# EasyEDA schematic SCH_GAME_SIM_2023-07-09.json

## Sheets
1 MCU: TITLE: SimSpirit MICROCONTROLLER  ESP32; REV: 1.0; Date: 2022-03-19; Sheet: 1/1; Drawn By: digitalman; Company: Analog-Digital Technologies
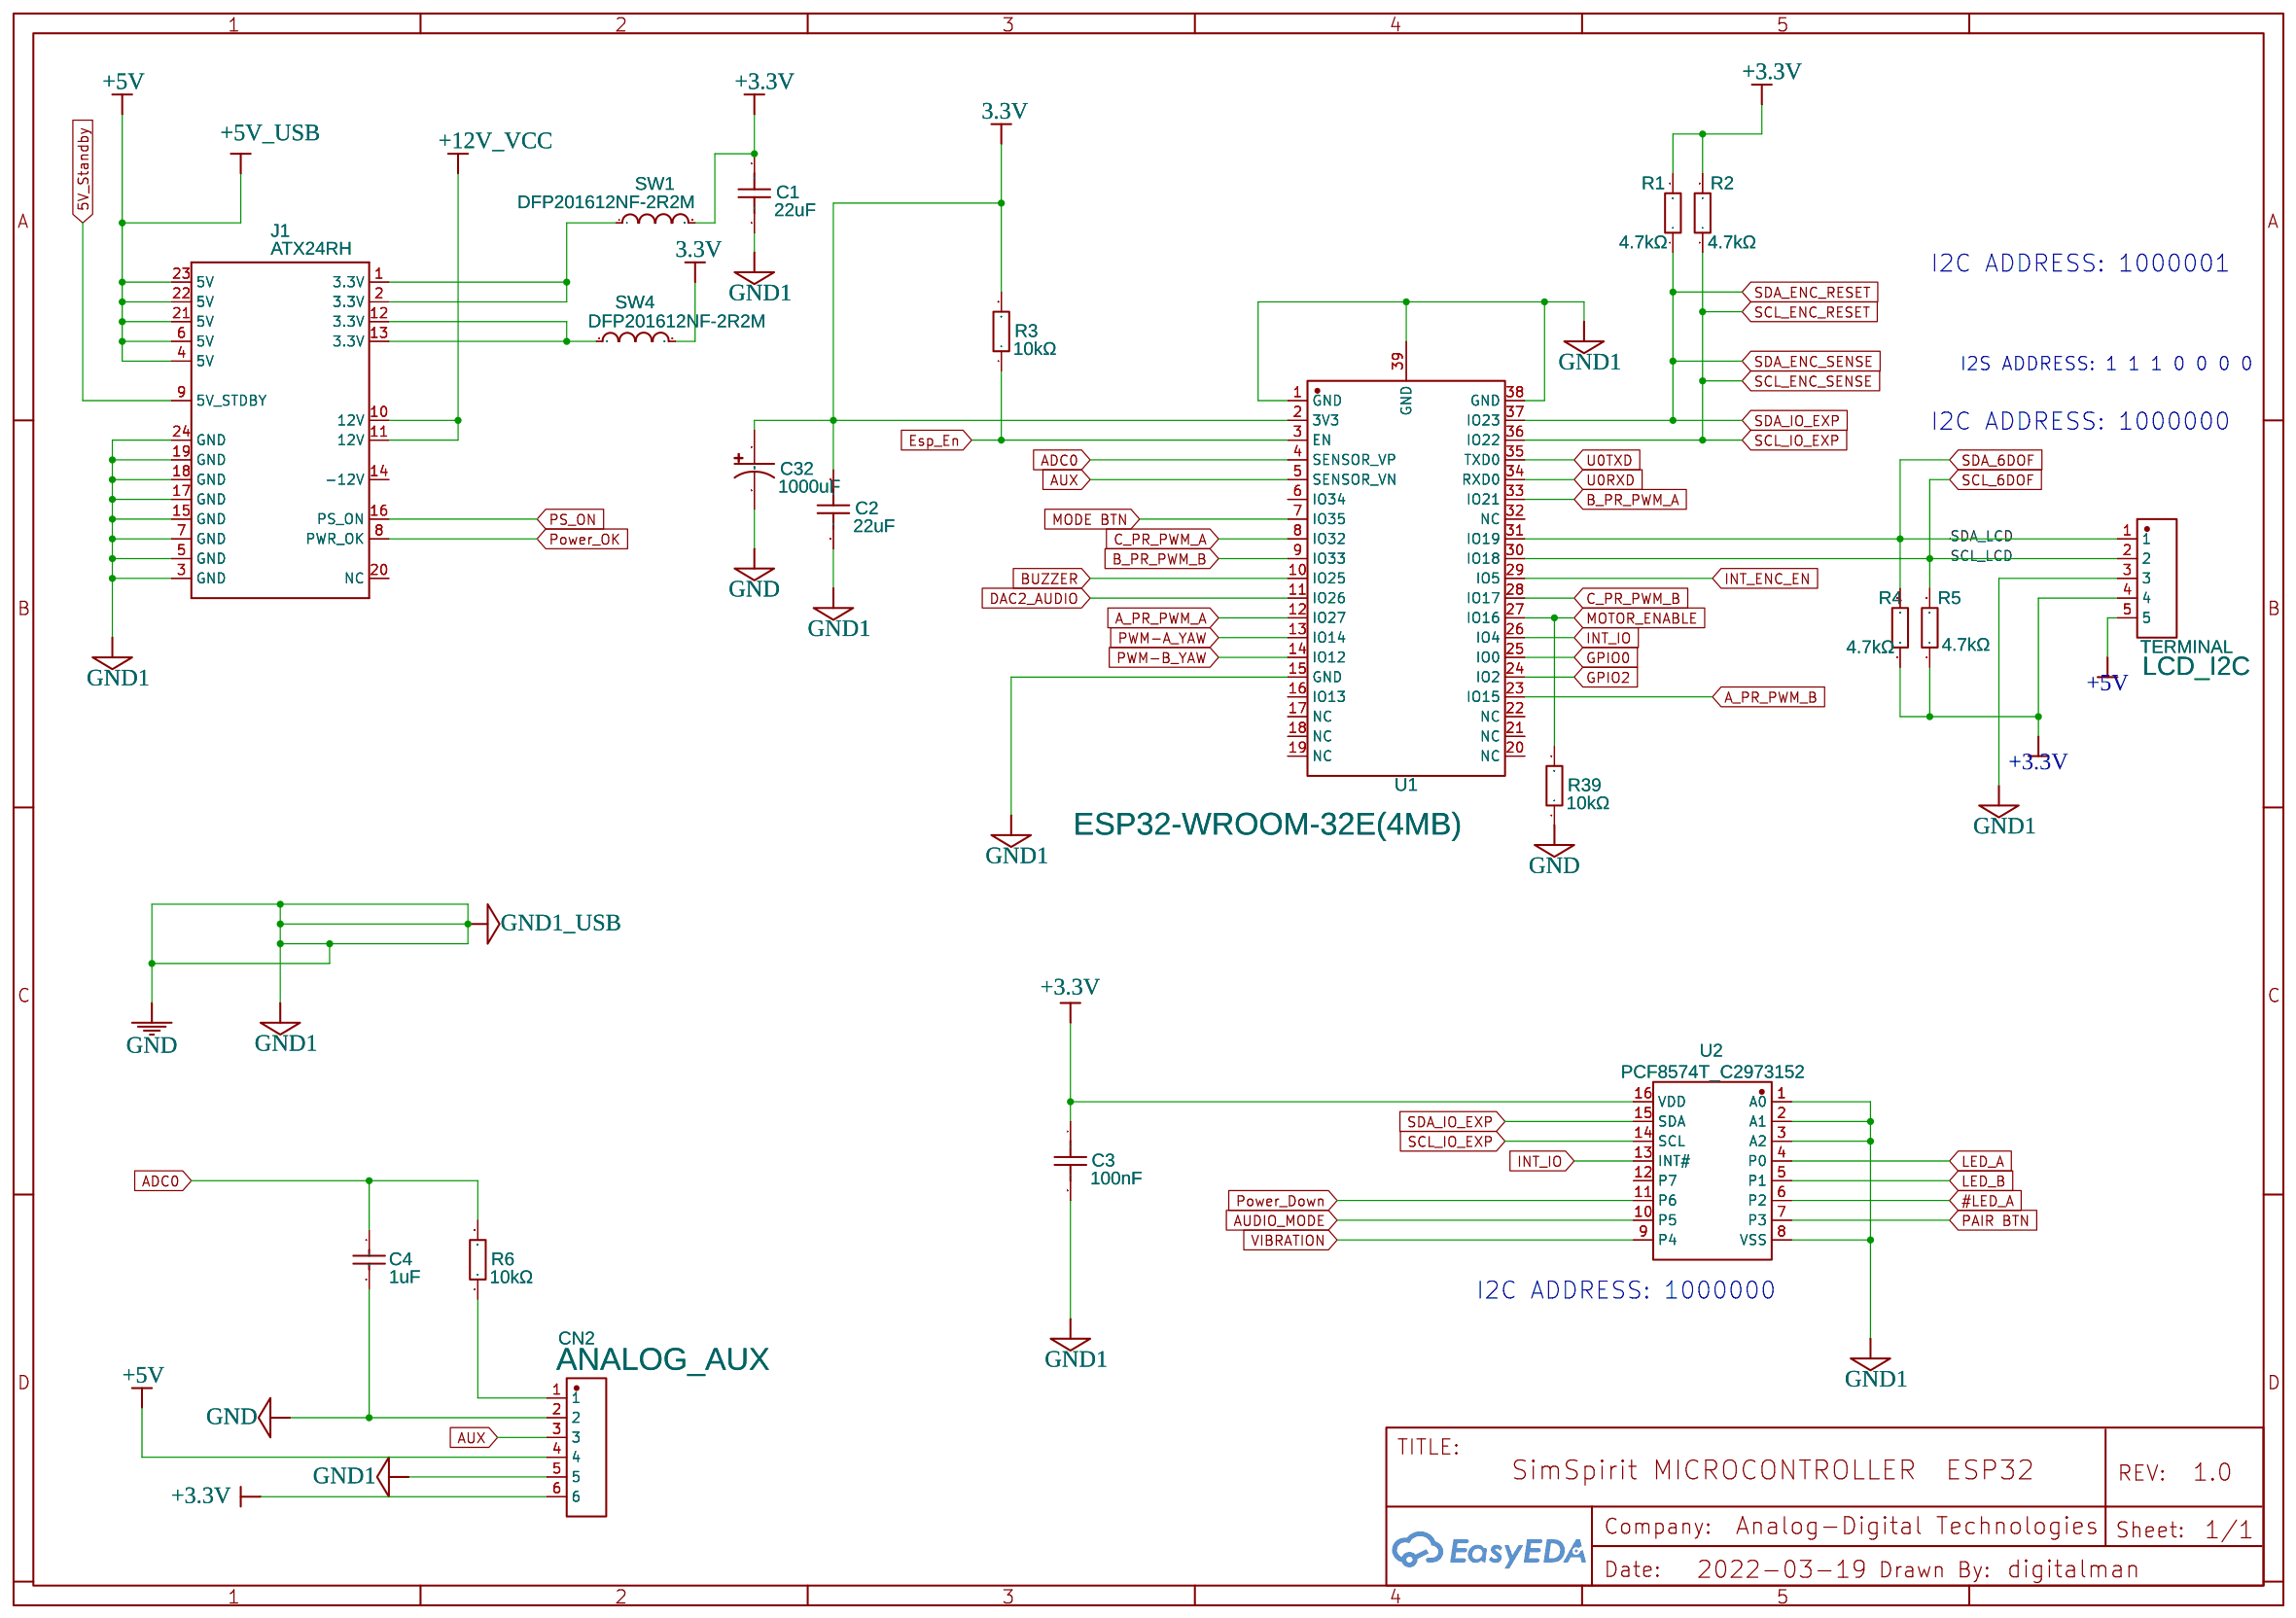
[diagram p0: MCU]
2 BUTTONS_LEDS: TITLE: SWITH AND BUTTONS; Date: 2022-03-21
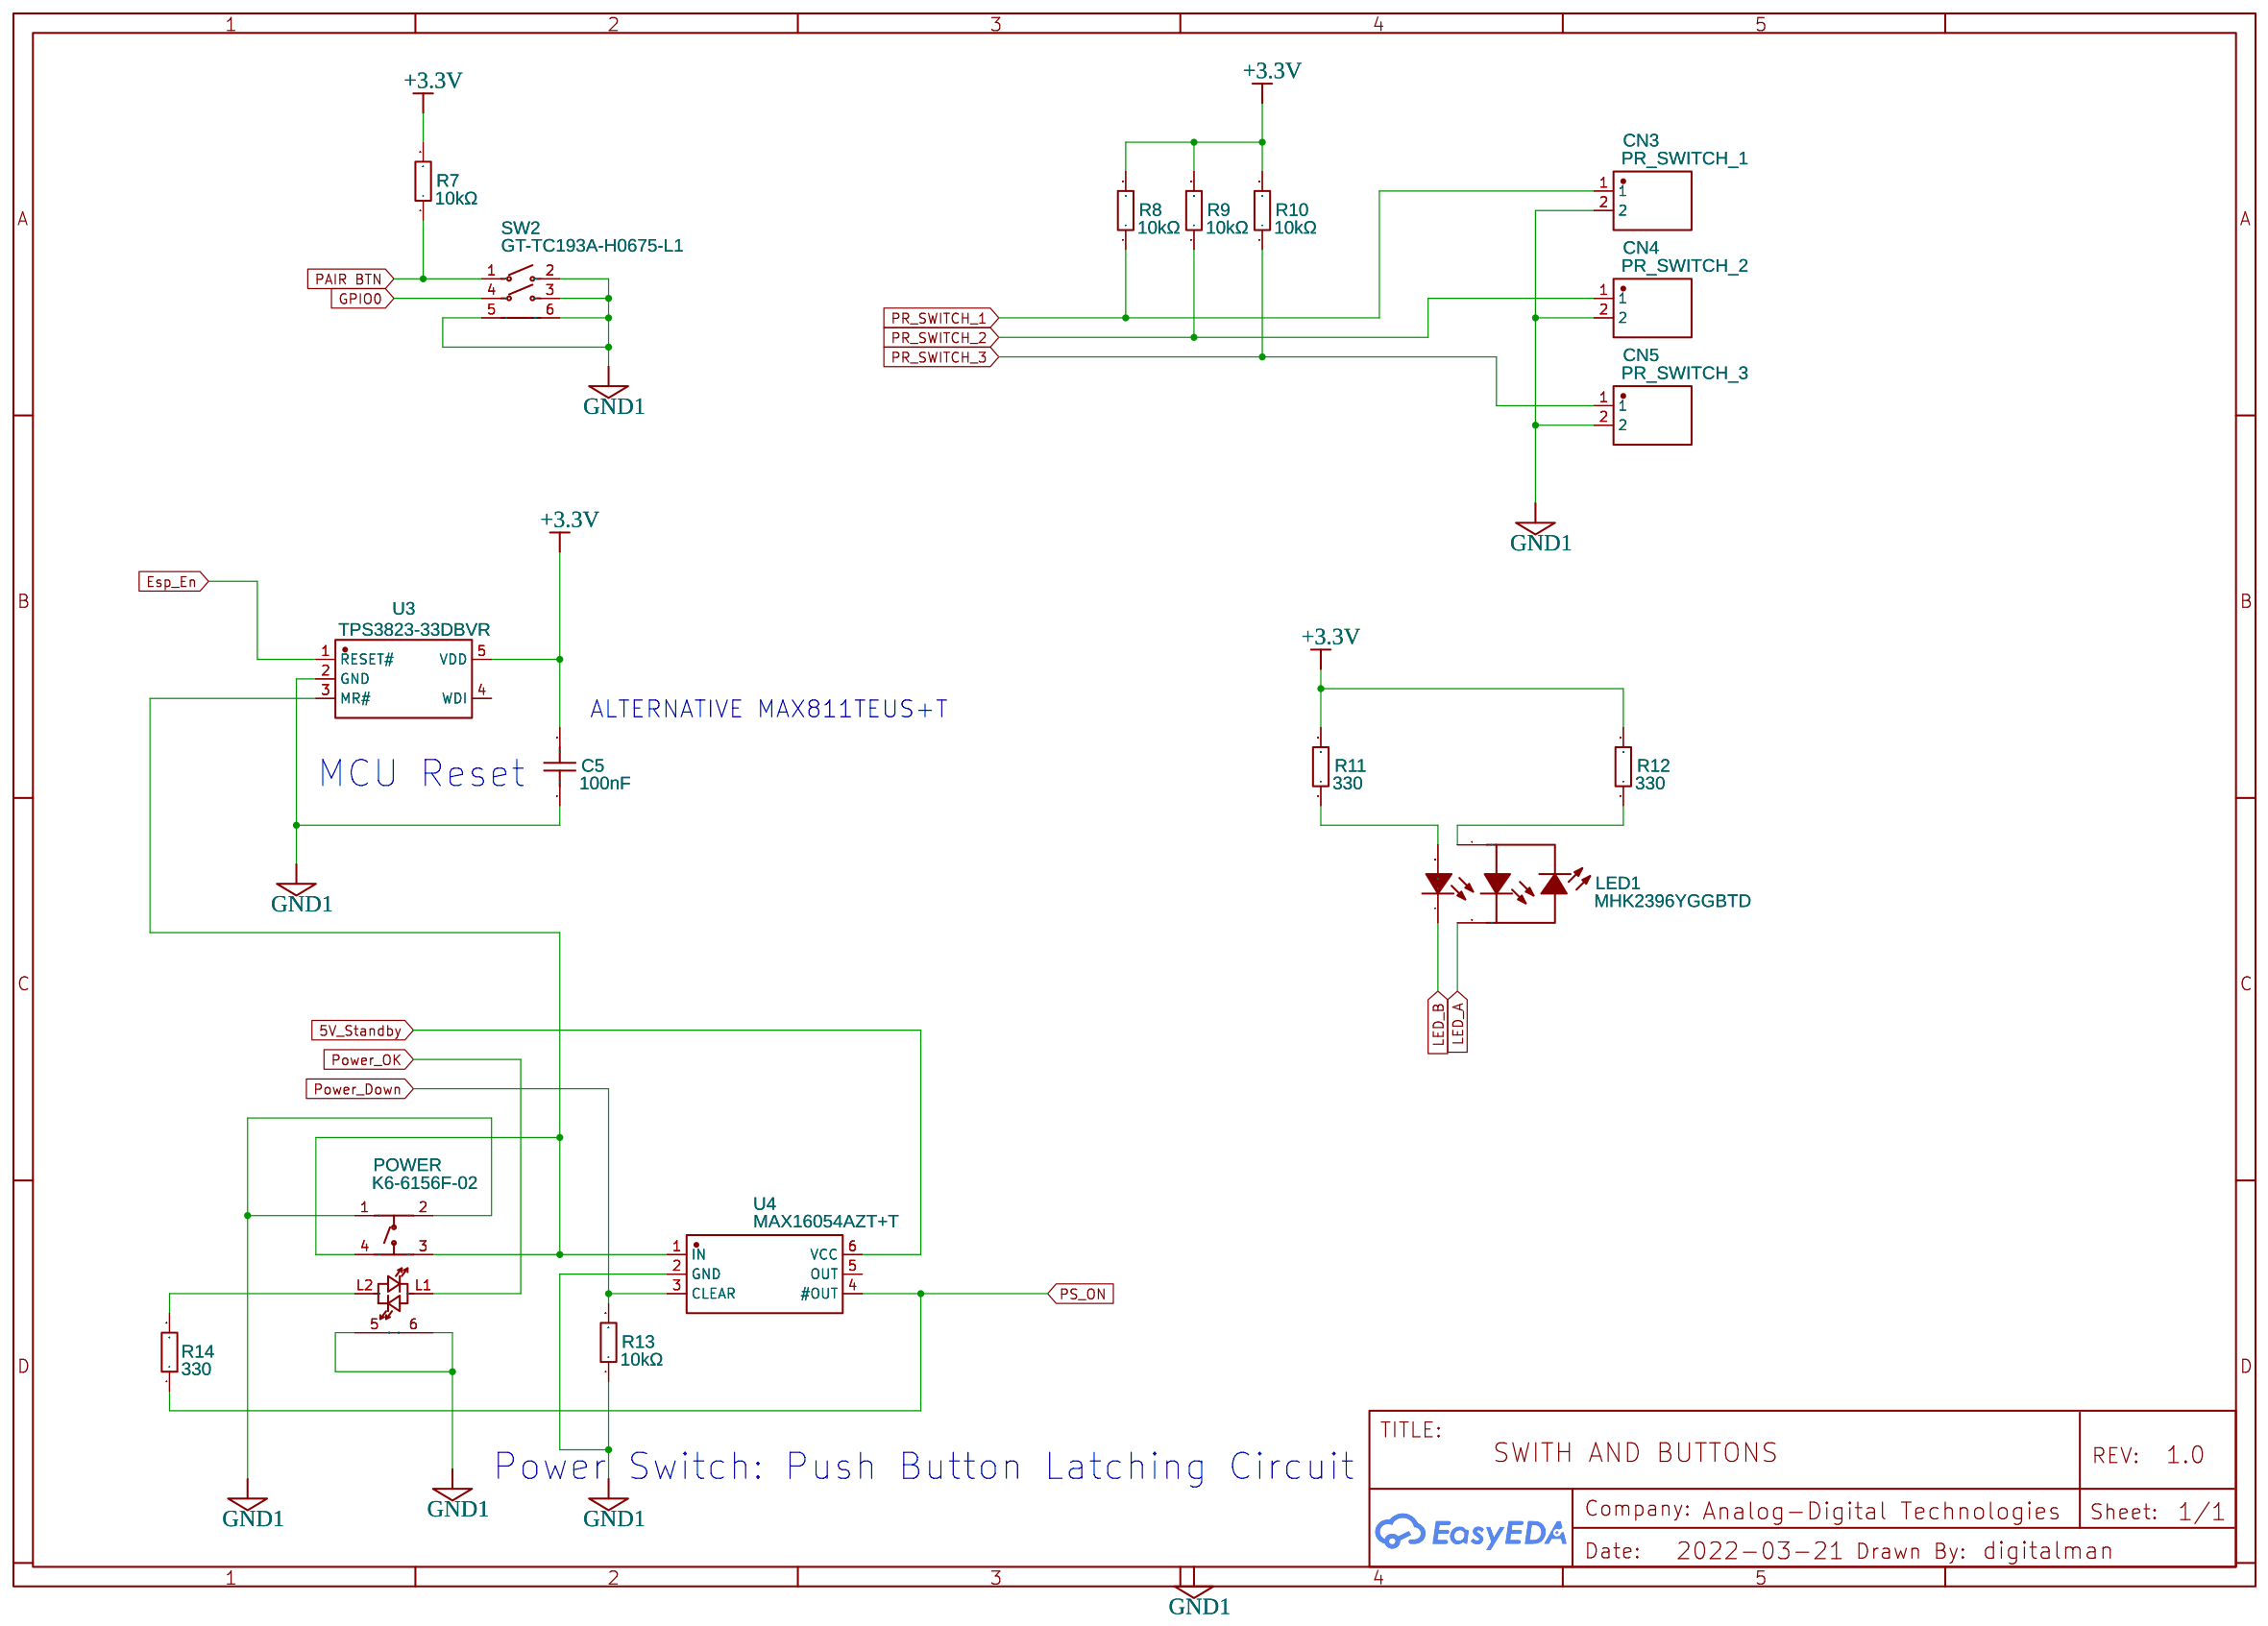
[diagram p1: BUTTONS_LEDS]
3 USB_SERIAL: TITLE: USB SERIAL COMMUNICATION; Date: 2022-03-21
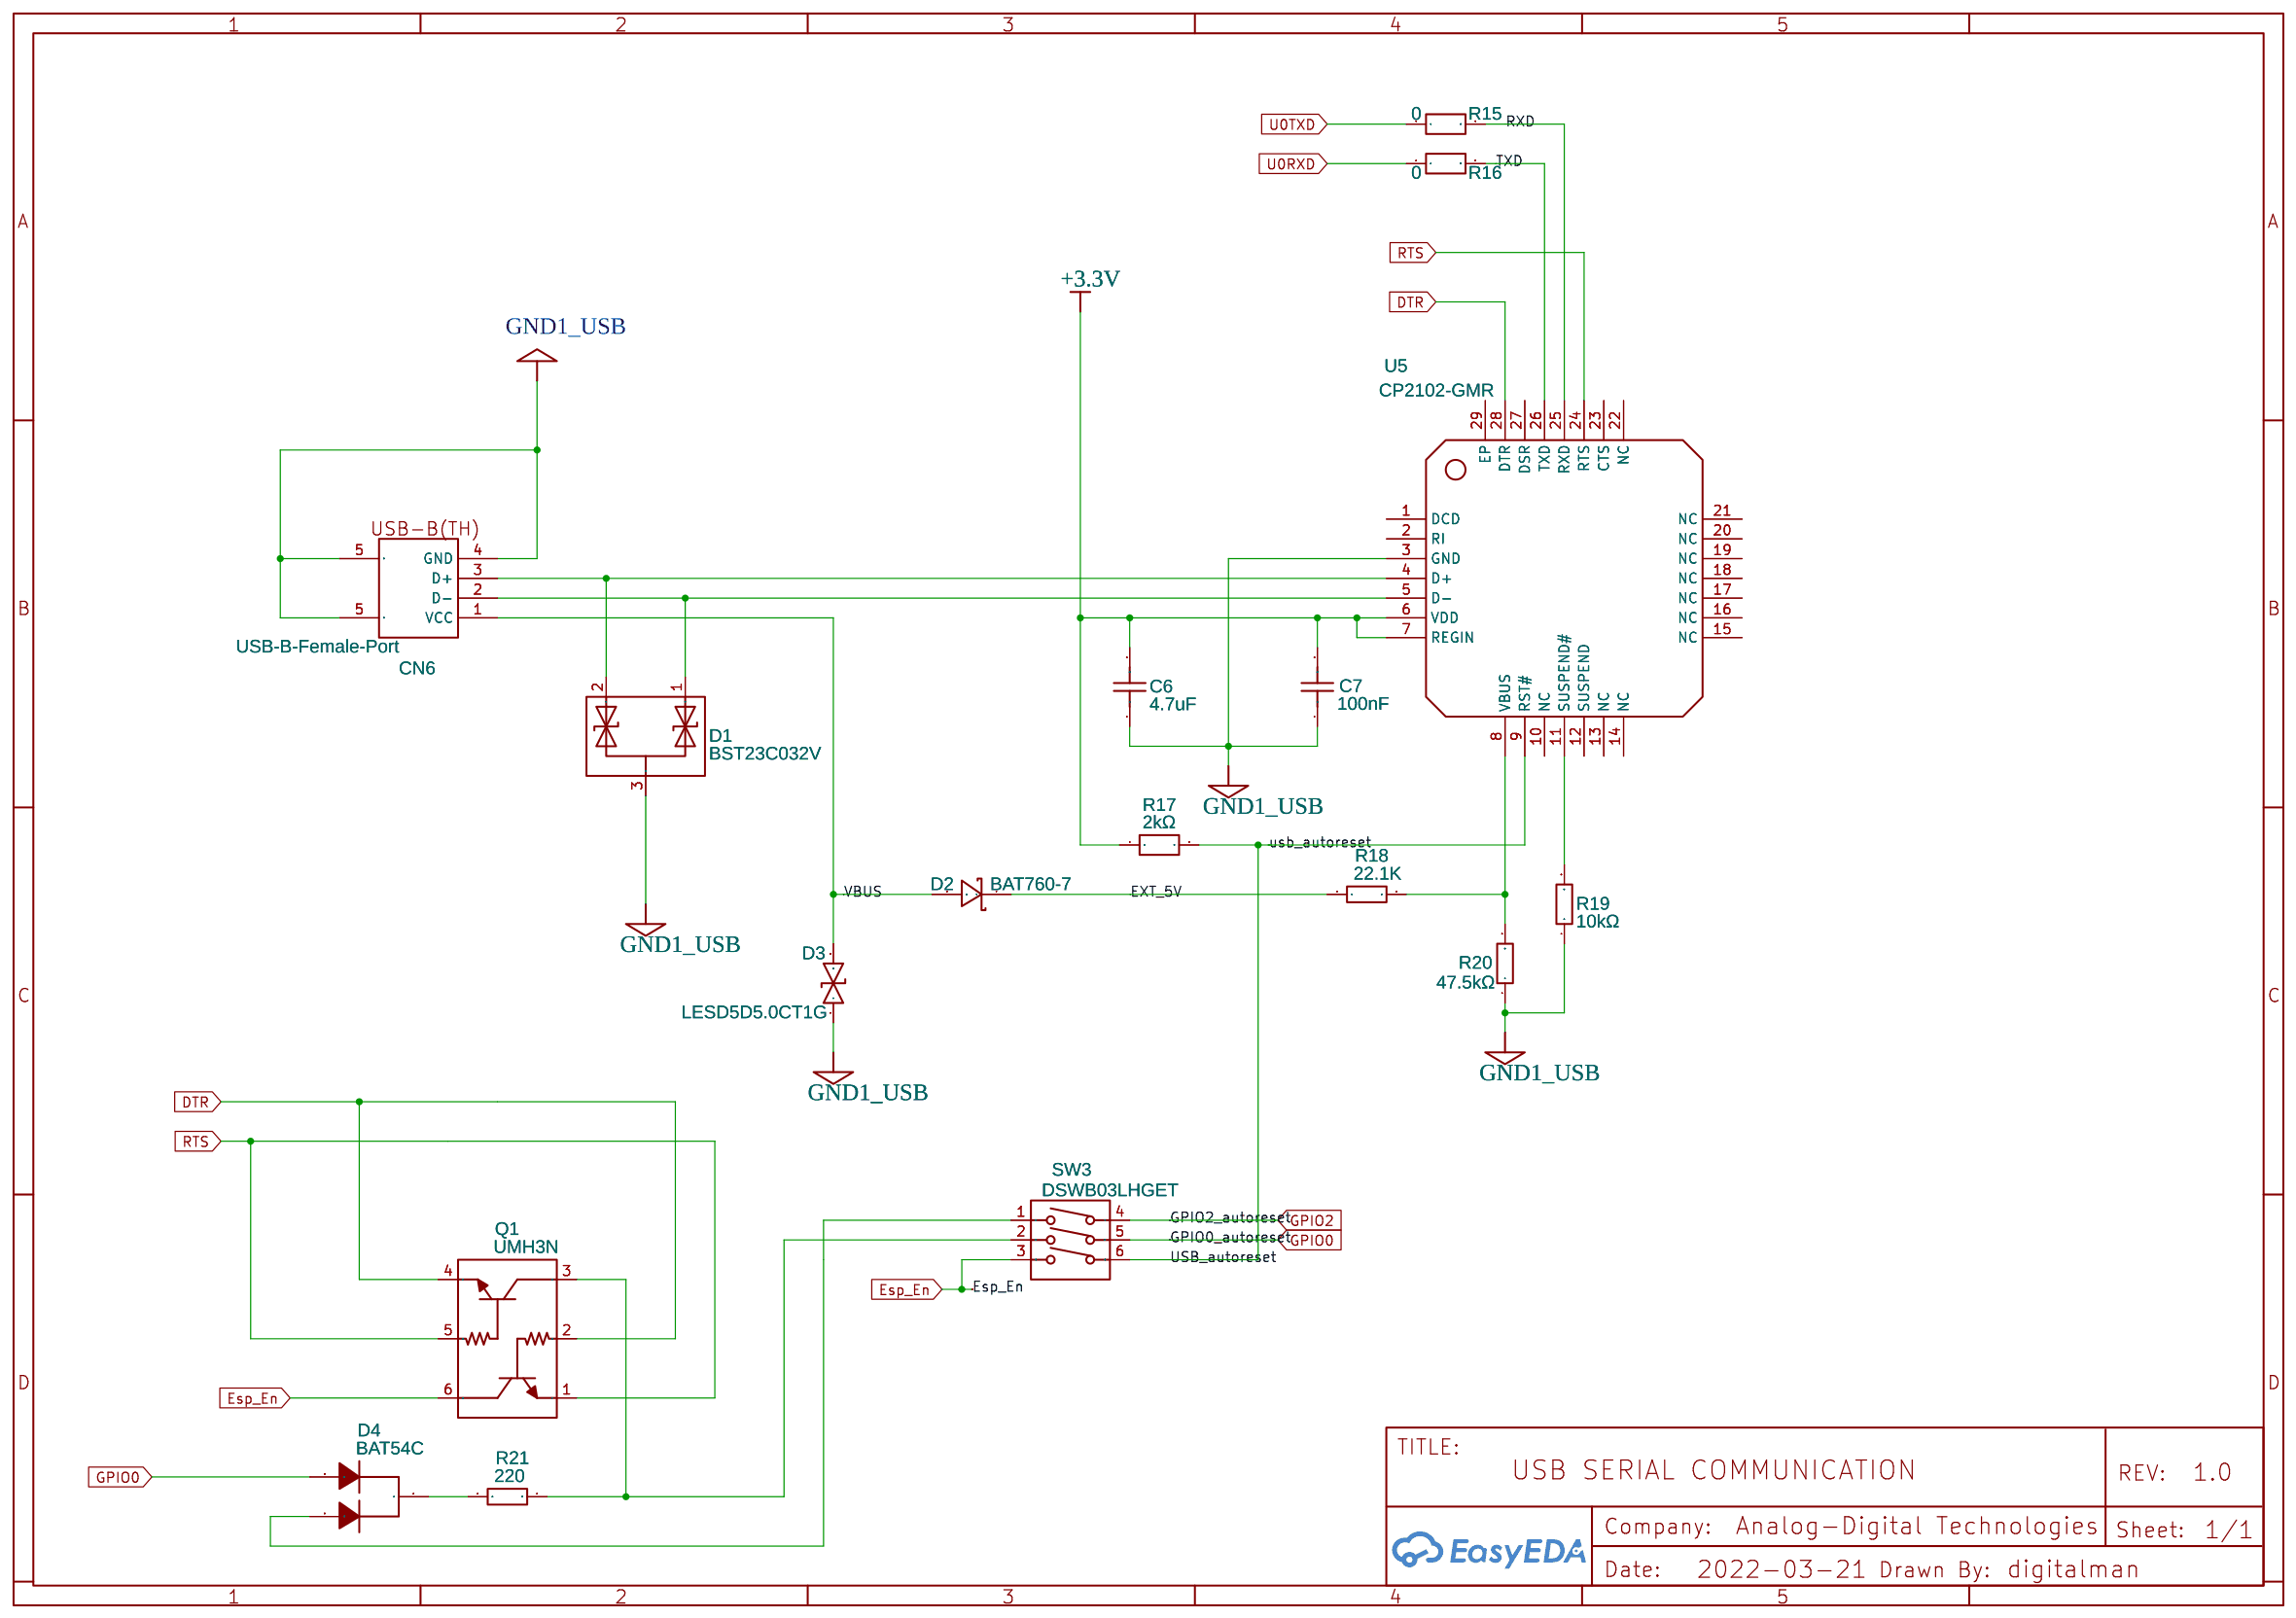
[diagram p2: USB_SERIAL]
4 6DOF: TITLE: IMU SENSOR; Date: 2022-03-22
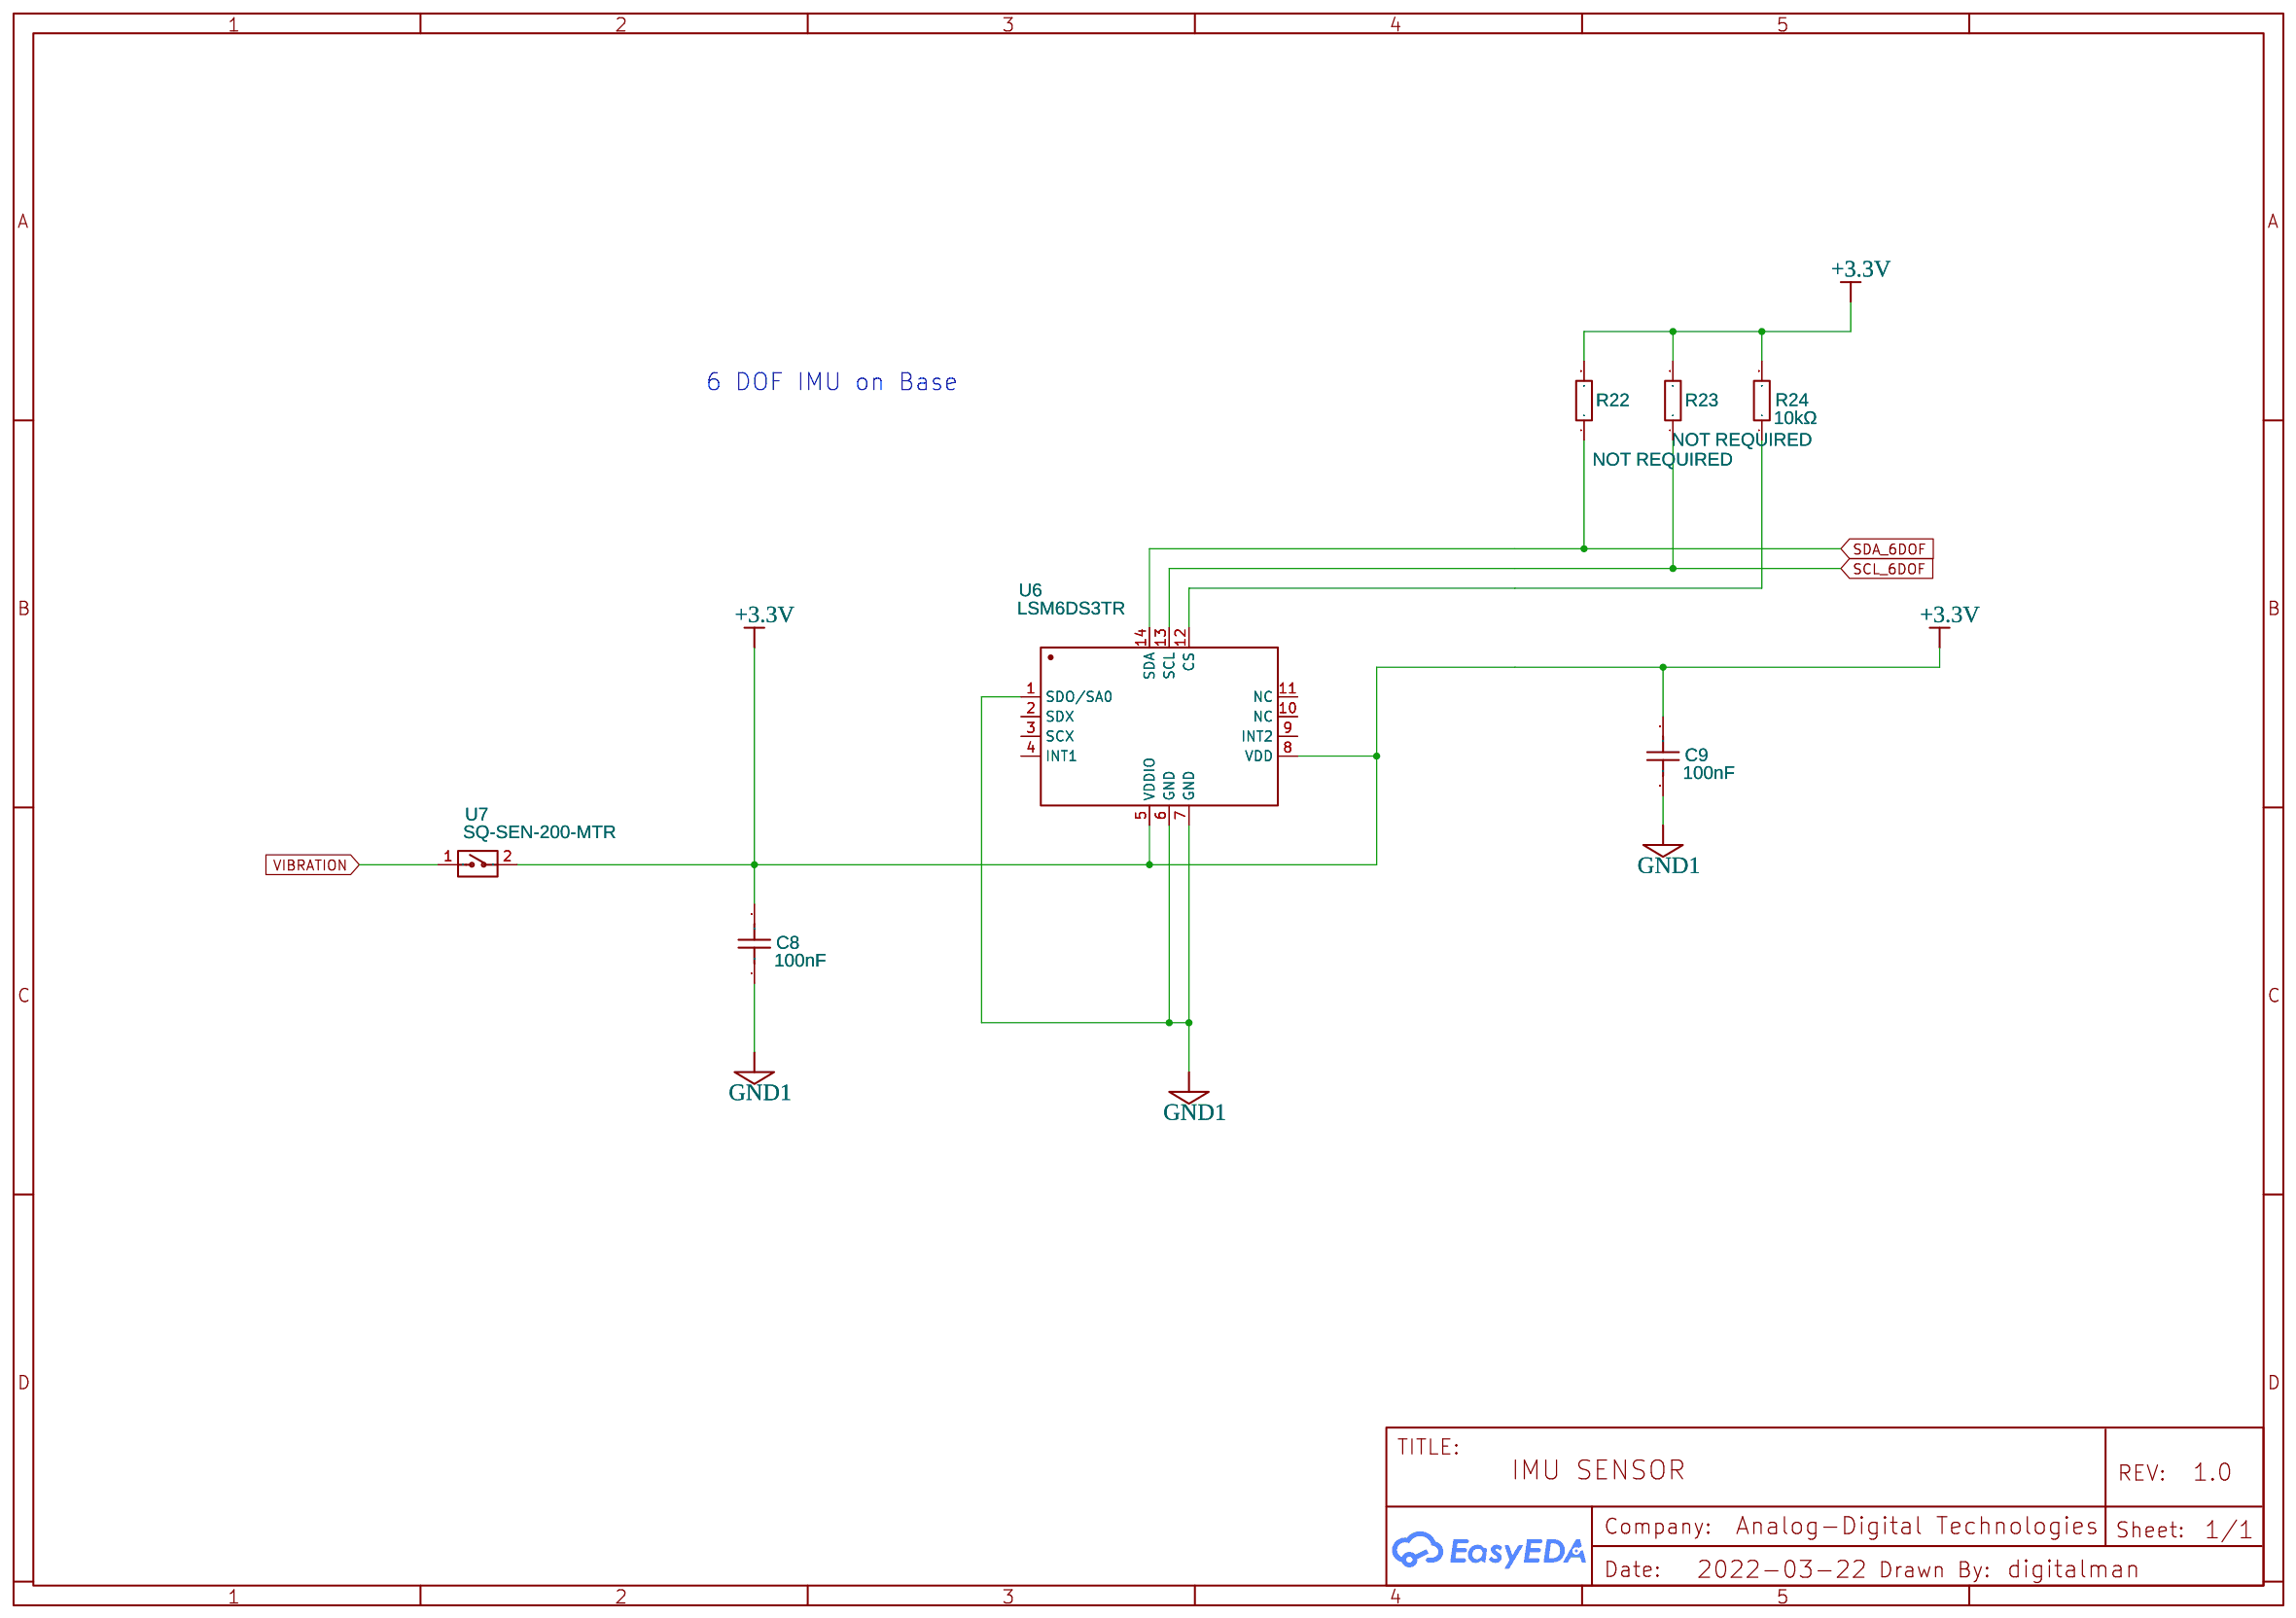
[diagram p3: 6DOF]
5 SOUND BUZZER: TITLE: SOUND BUZZER; Date: 2022-03-23
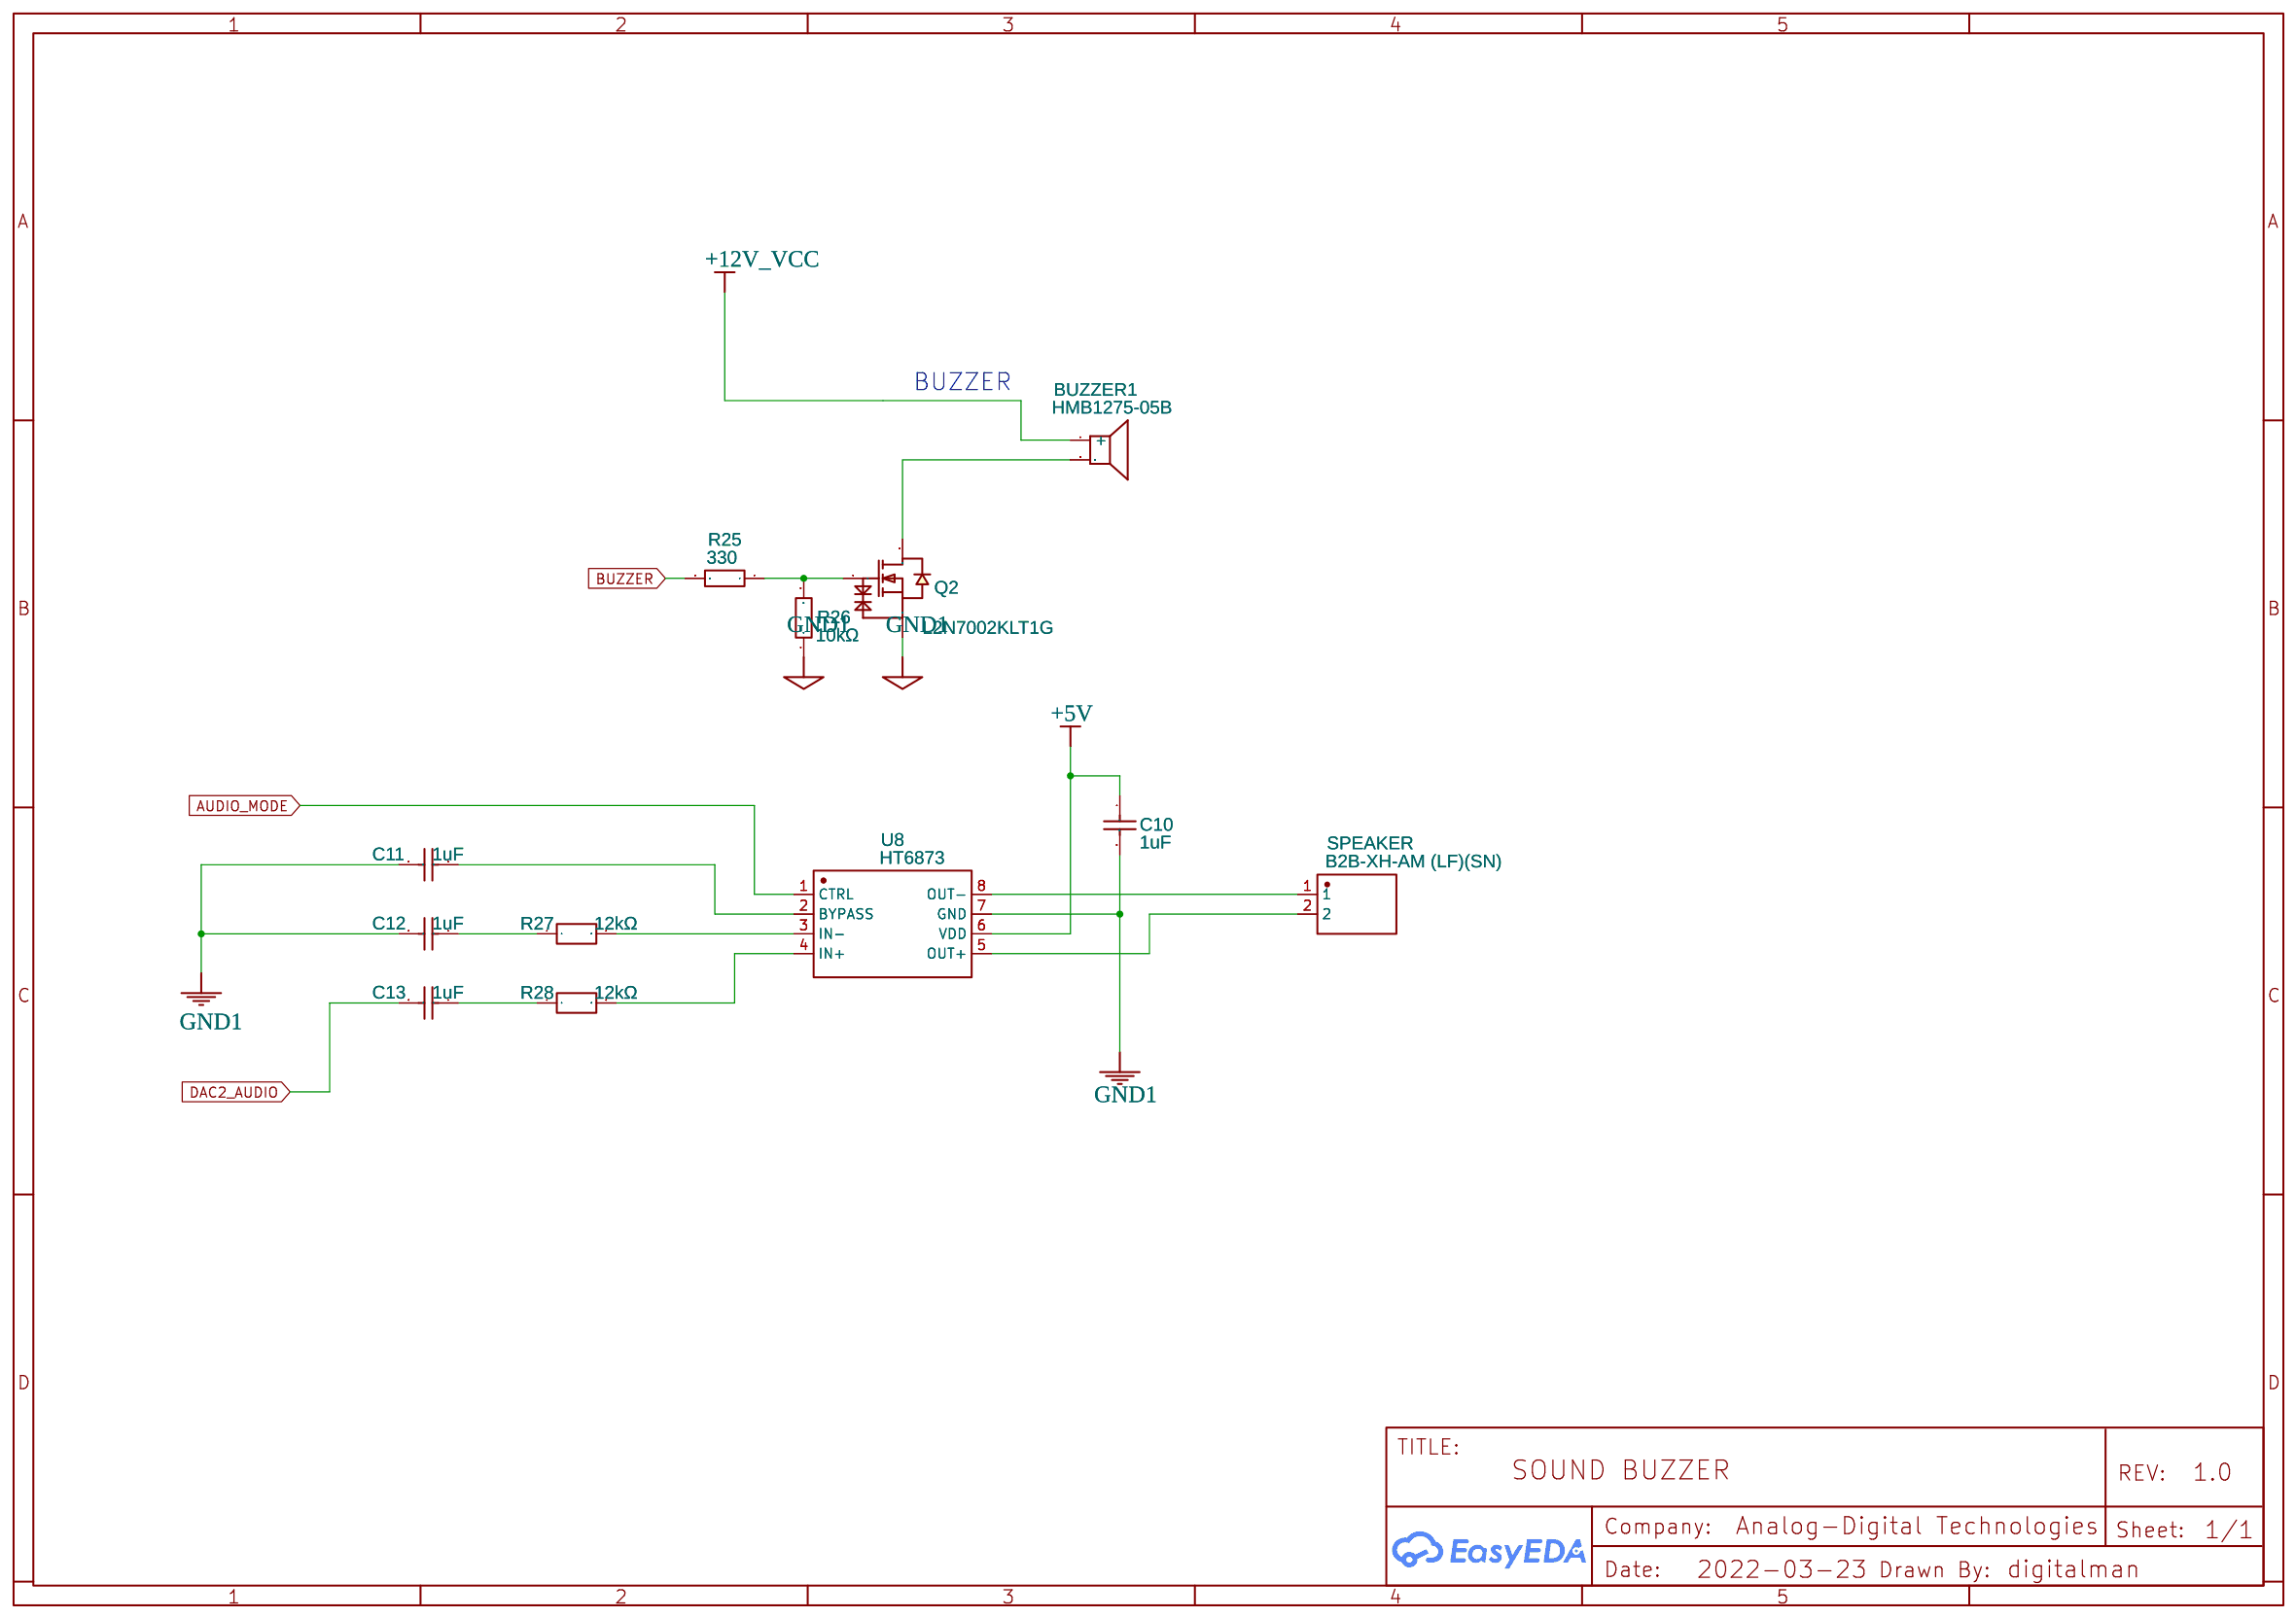
[diagram p4: SOUND BUZZER]
6 YAW_POWER: TITLE: YAW_CONTROL; Date: 2022-03-20
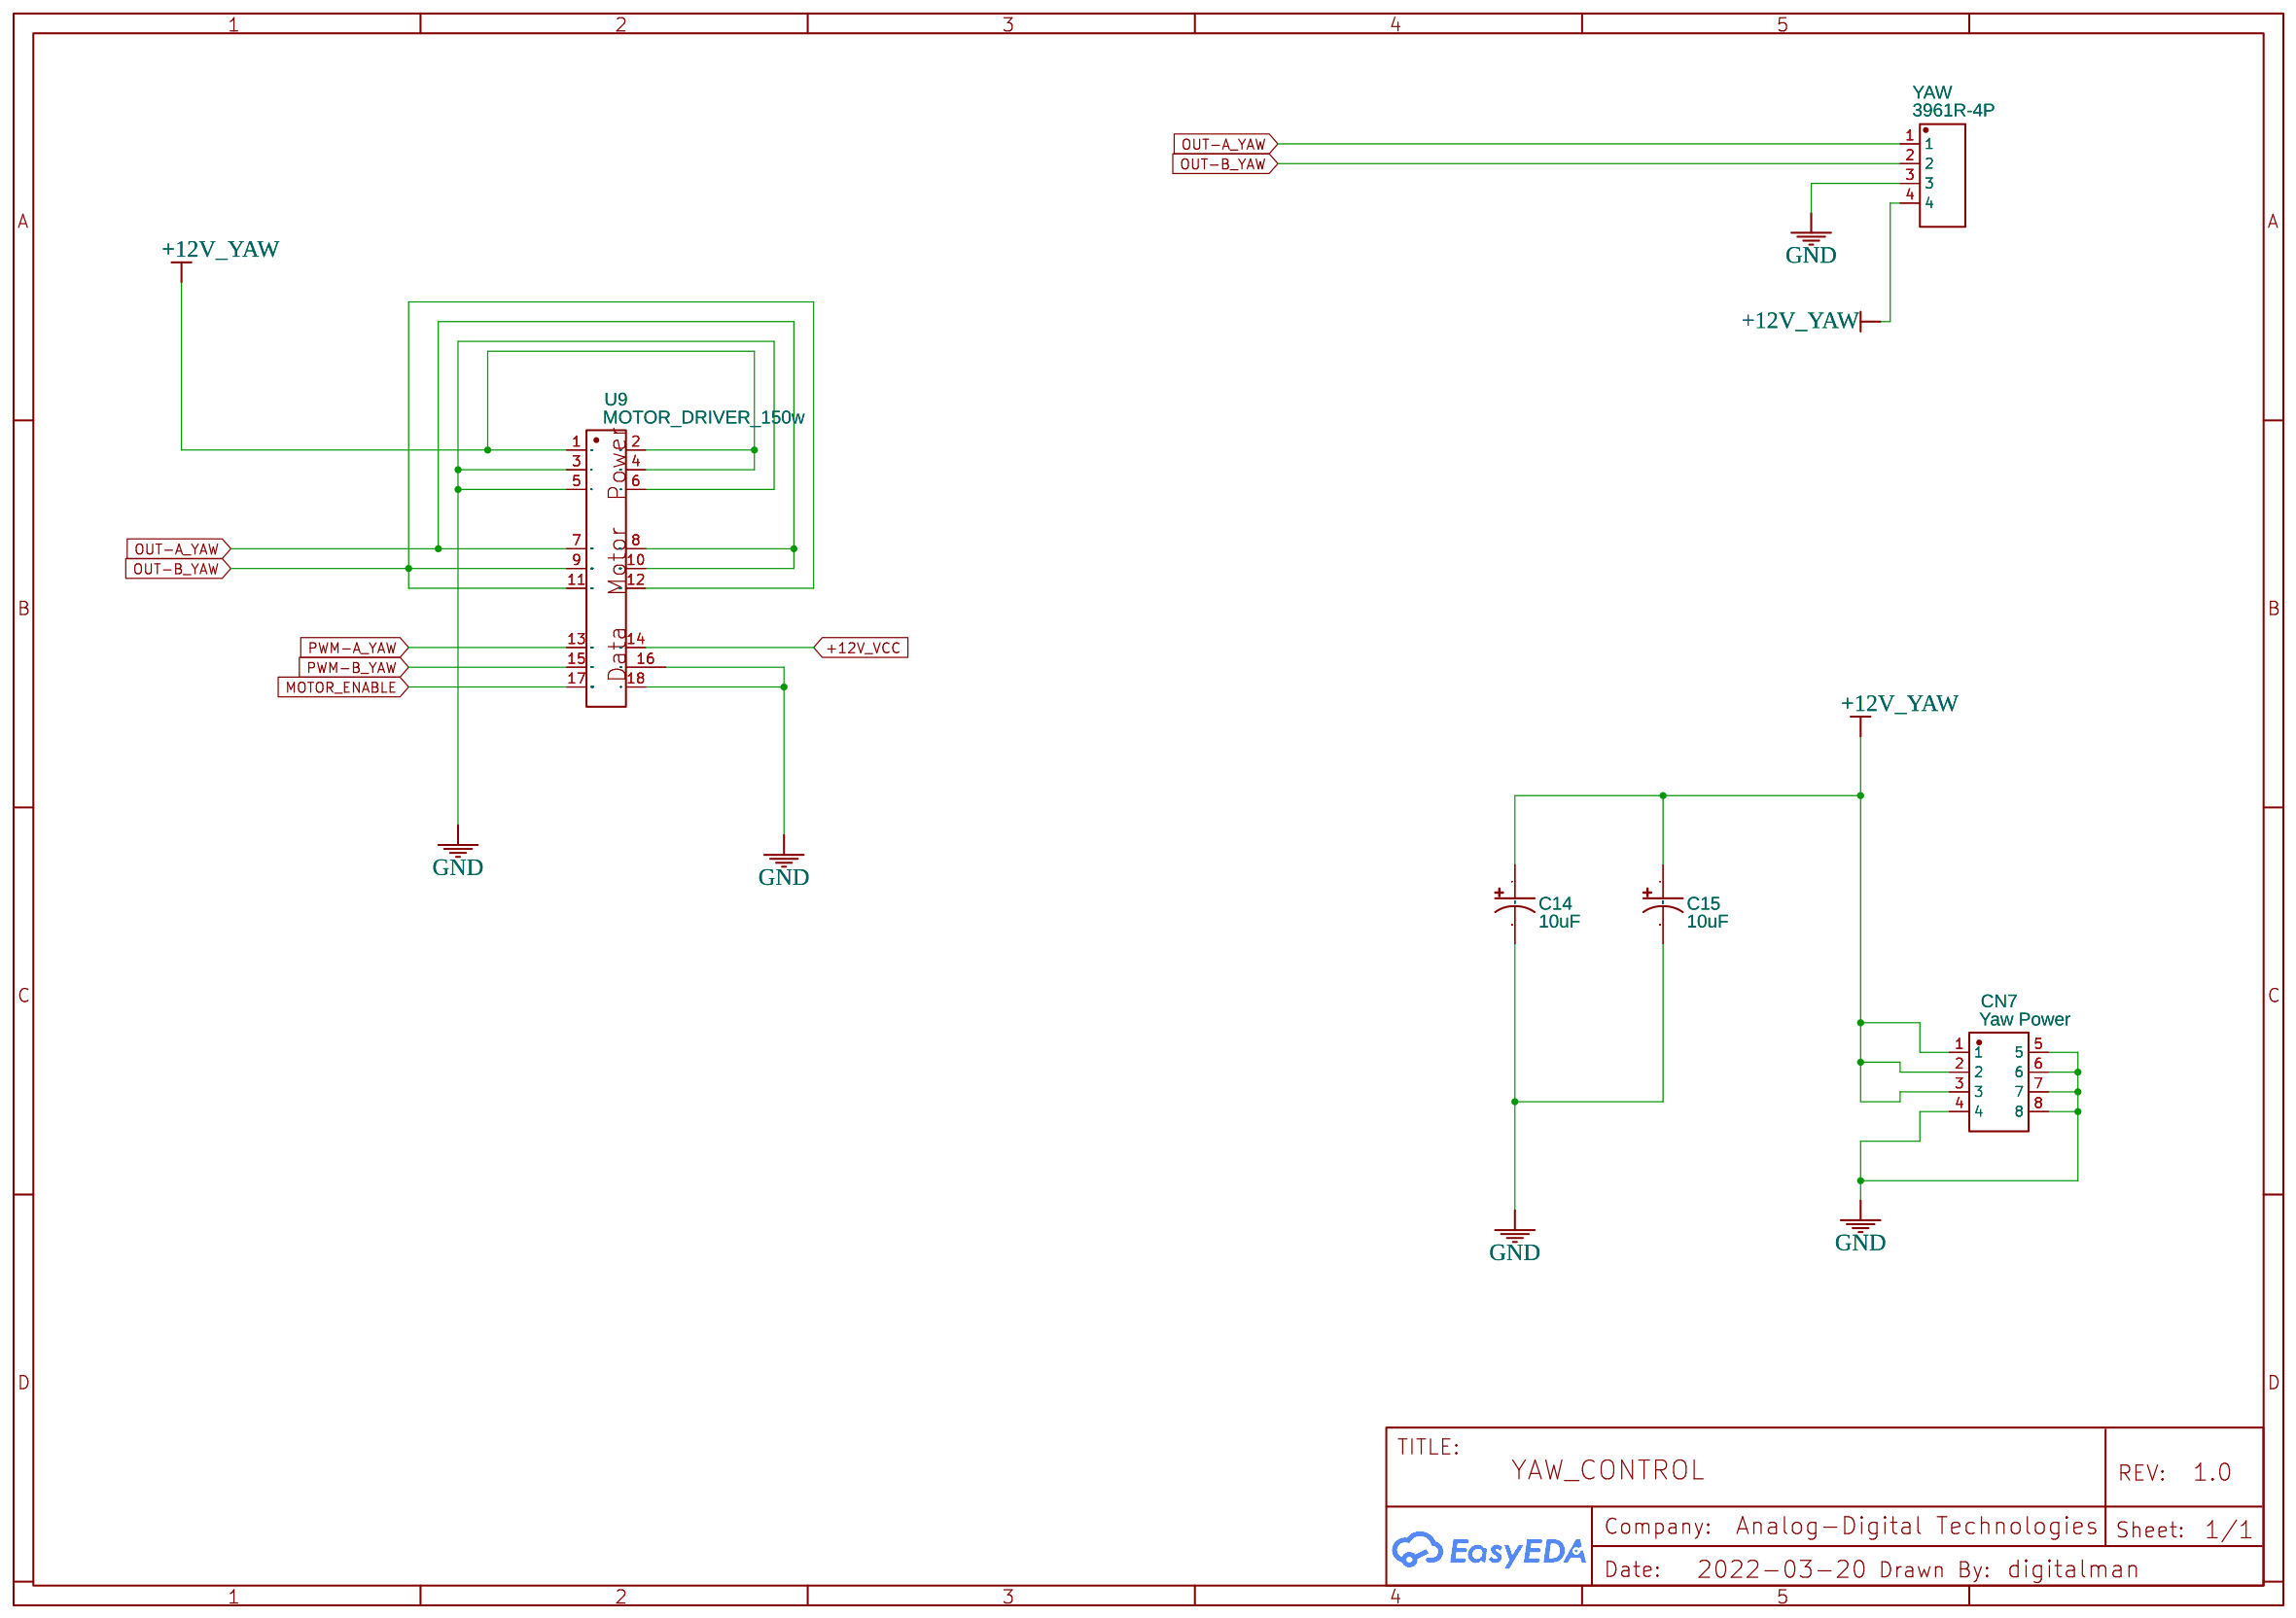
[diagram p5: YAW_POWER]
7 A_PITCHROLL: TITLE: PICTHROLL-CONTROL_A; Date: 2022-03-23
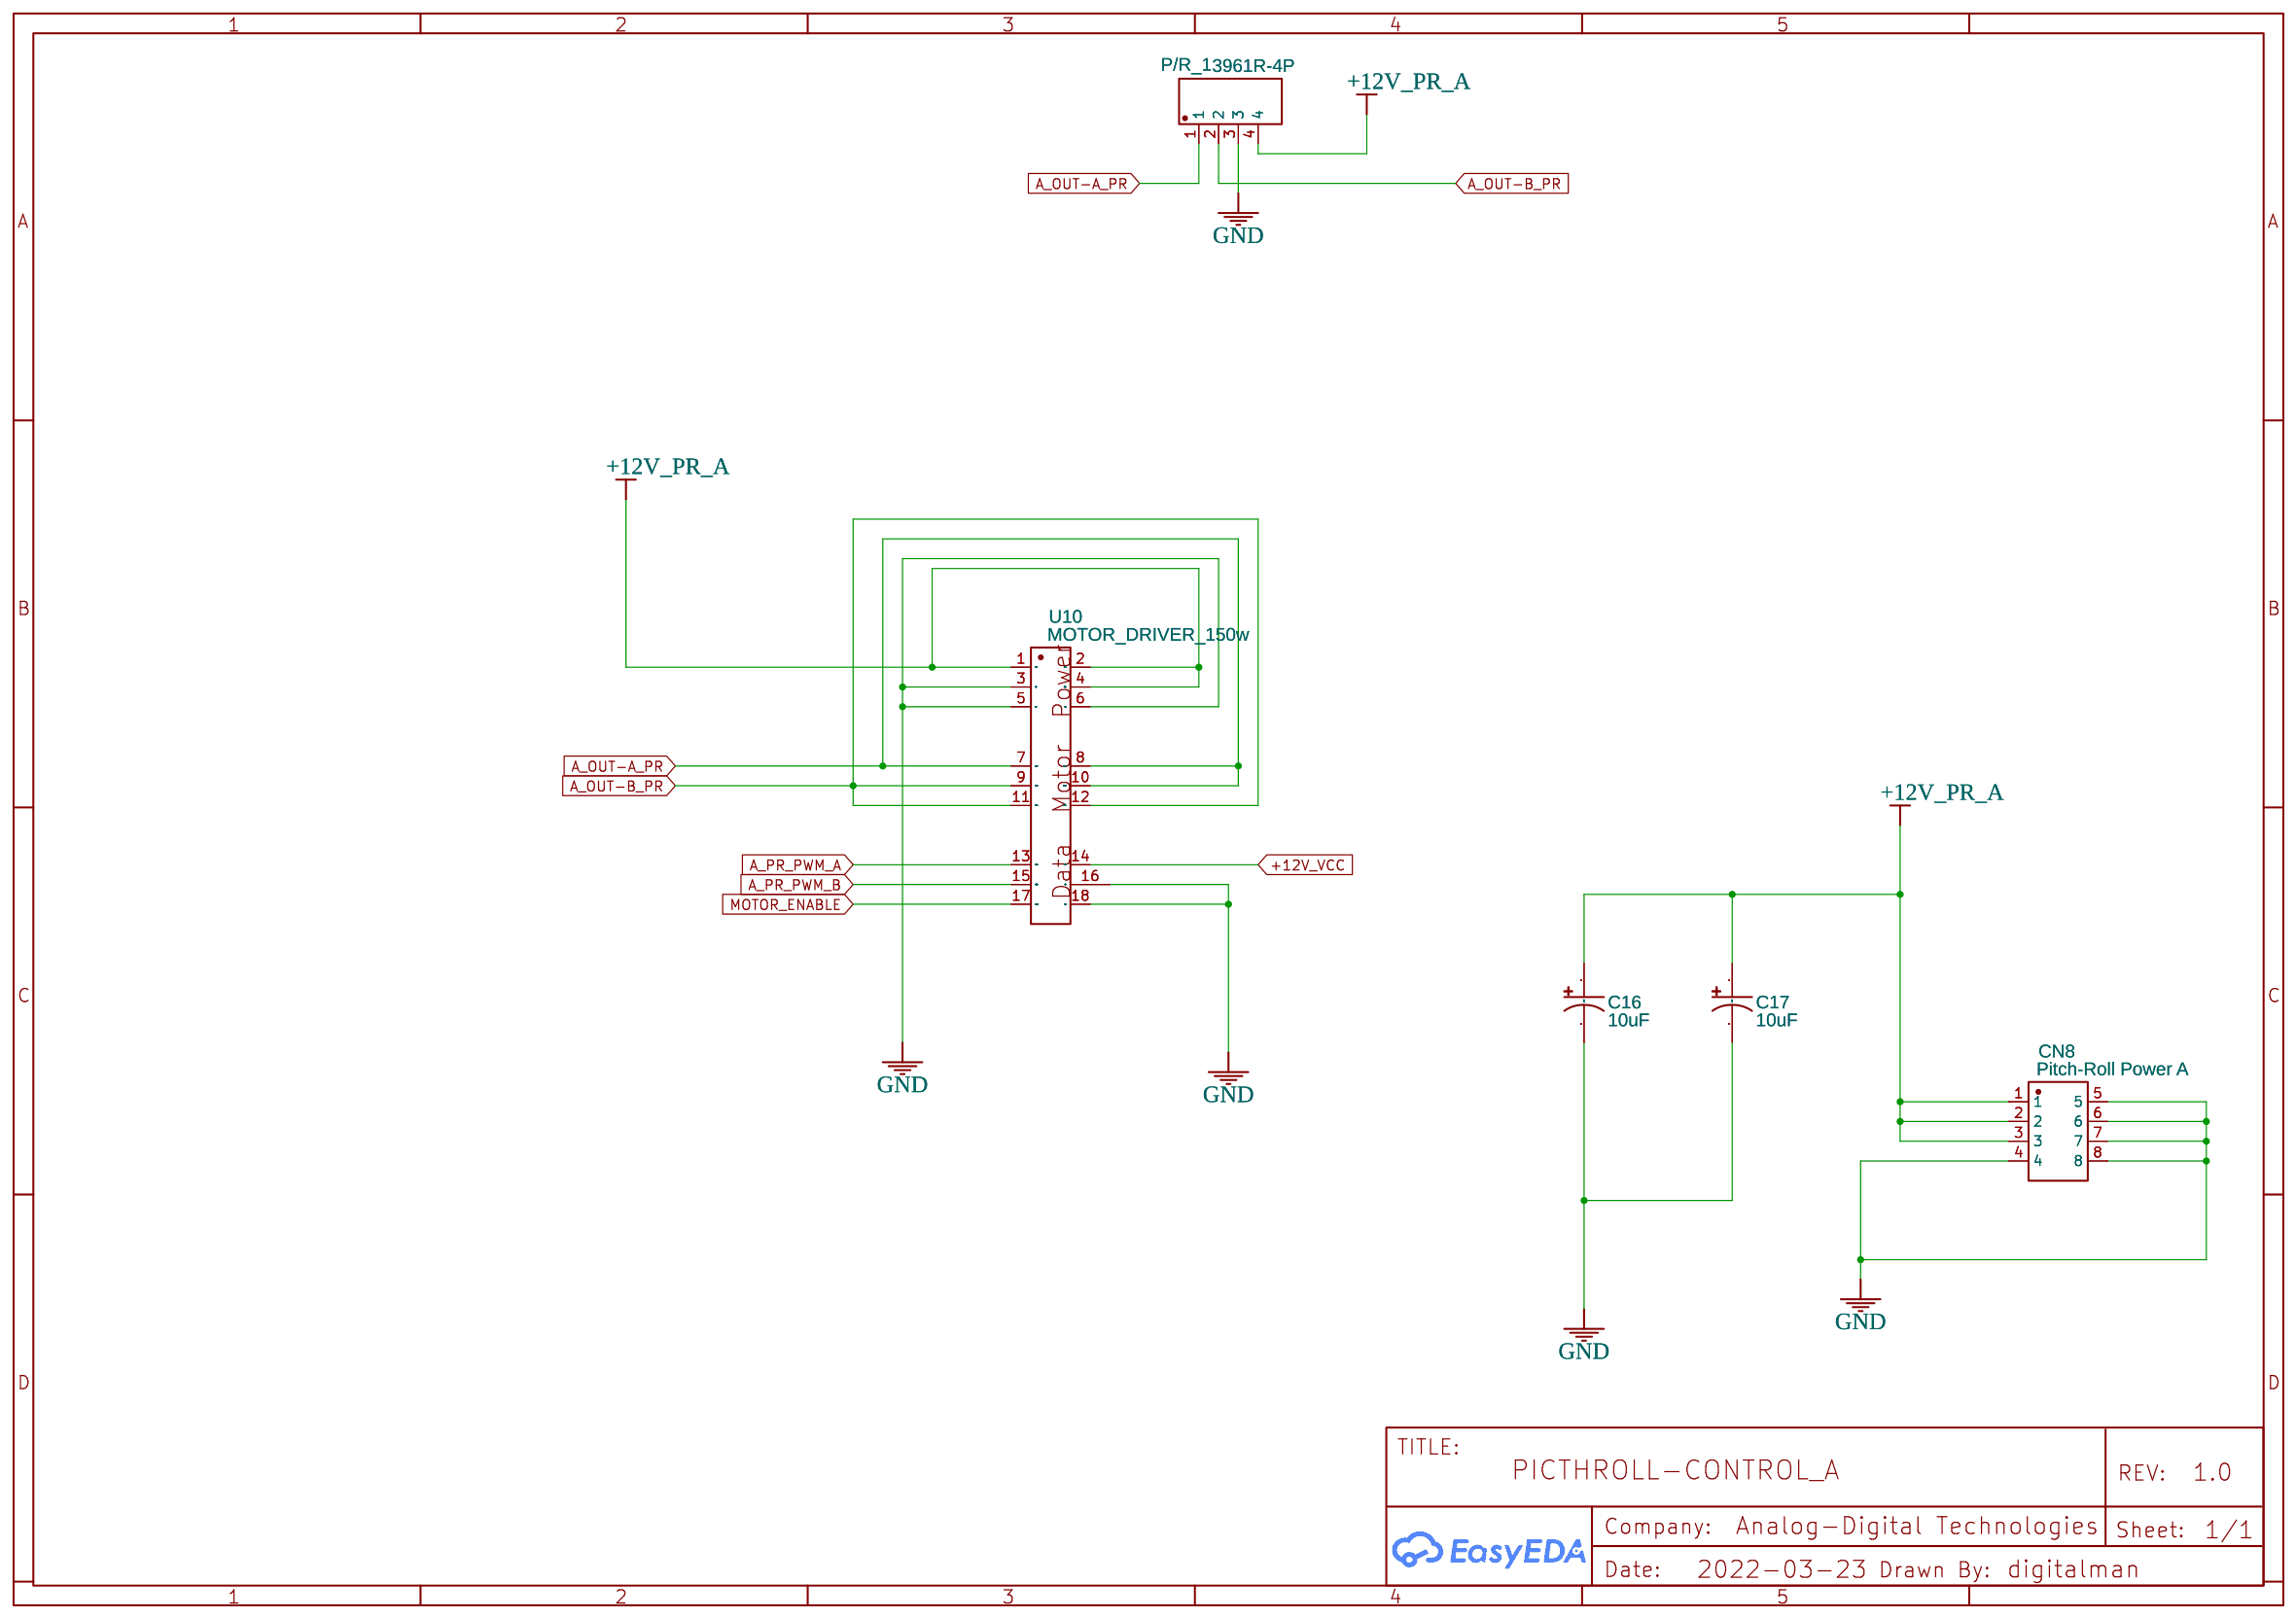
[diagram p6: A_PITCHROLL]
8 B_PITCHROLLER: TITLE: PITCHROLL CONTROL B; Date: 2022-03-23
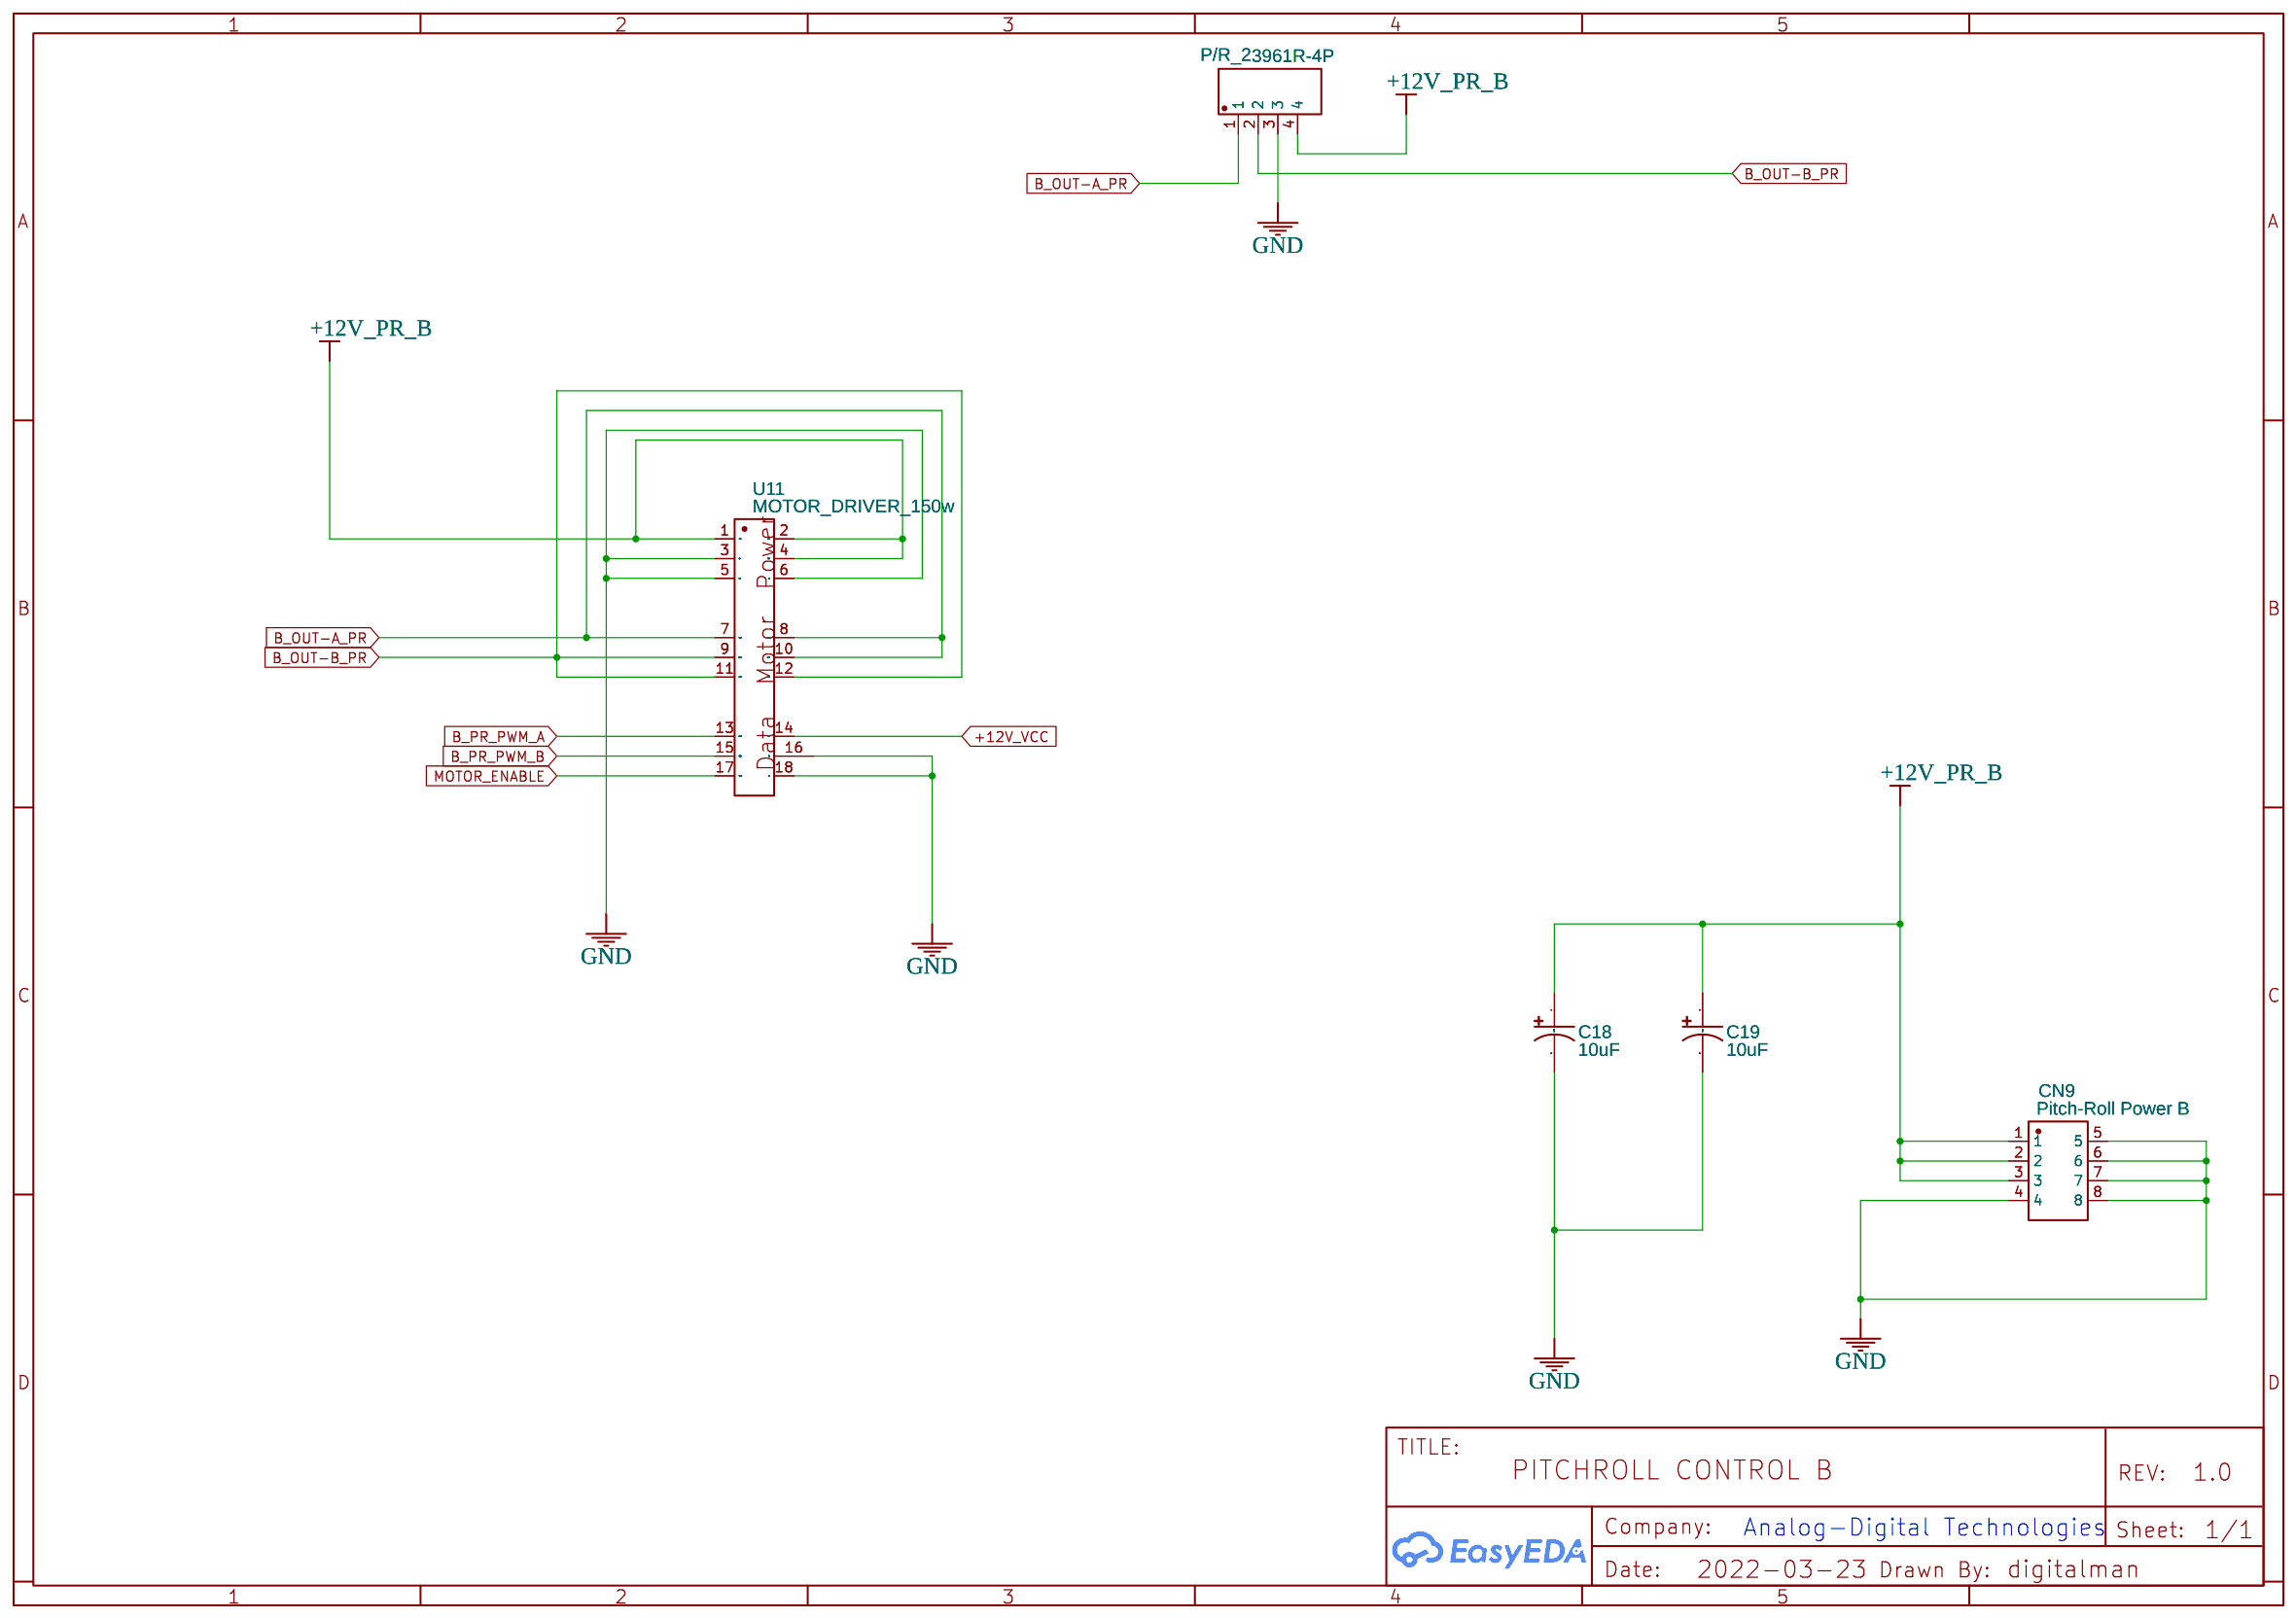
[diagram p7: B_PITCHROLLER]
9 C_PITCHROLLER: TITLE: PITCHROL CONTROL C; Date: 2022-03-23
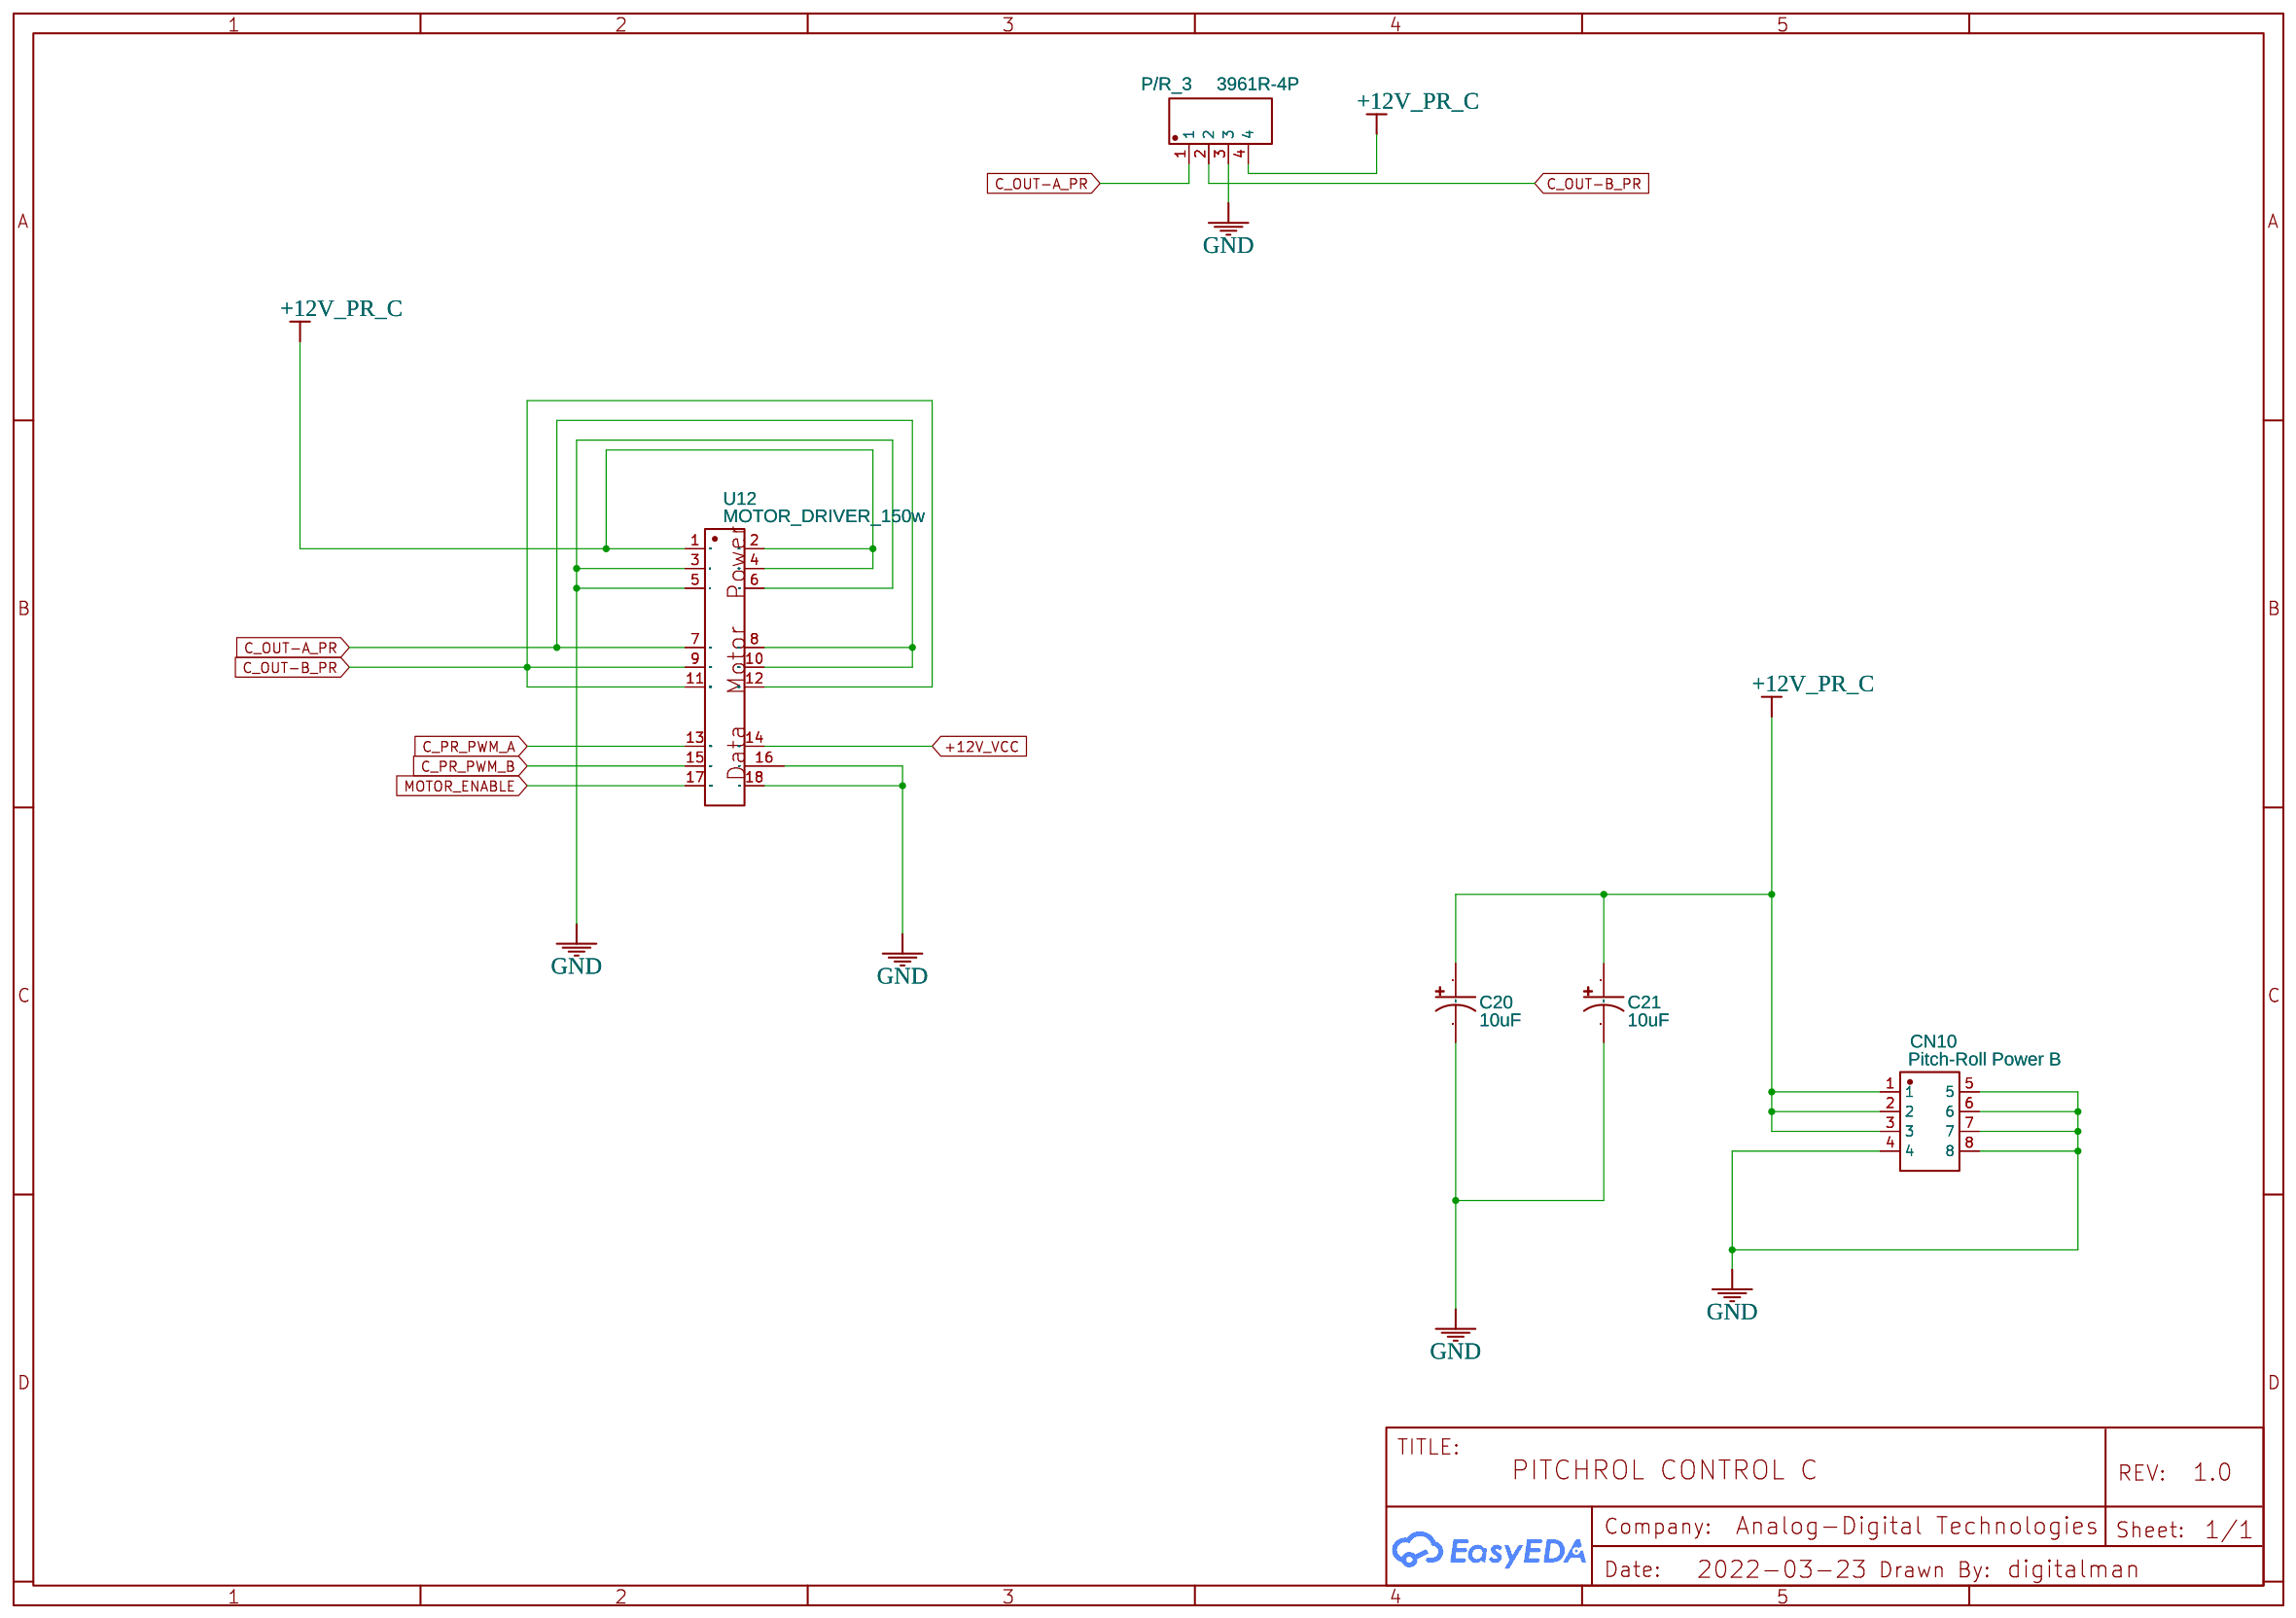
[diagram p8: C_PITCHROLLER]
10 ENC_SENSOR: TITLE: ENCODER SENSOR CONTROL; Date: 2022-03-23
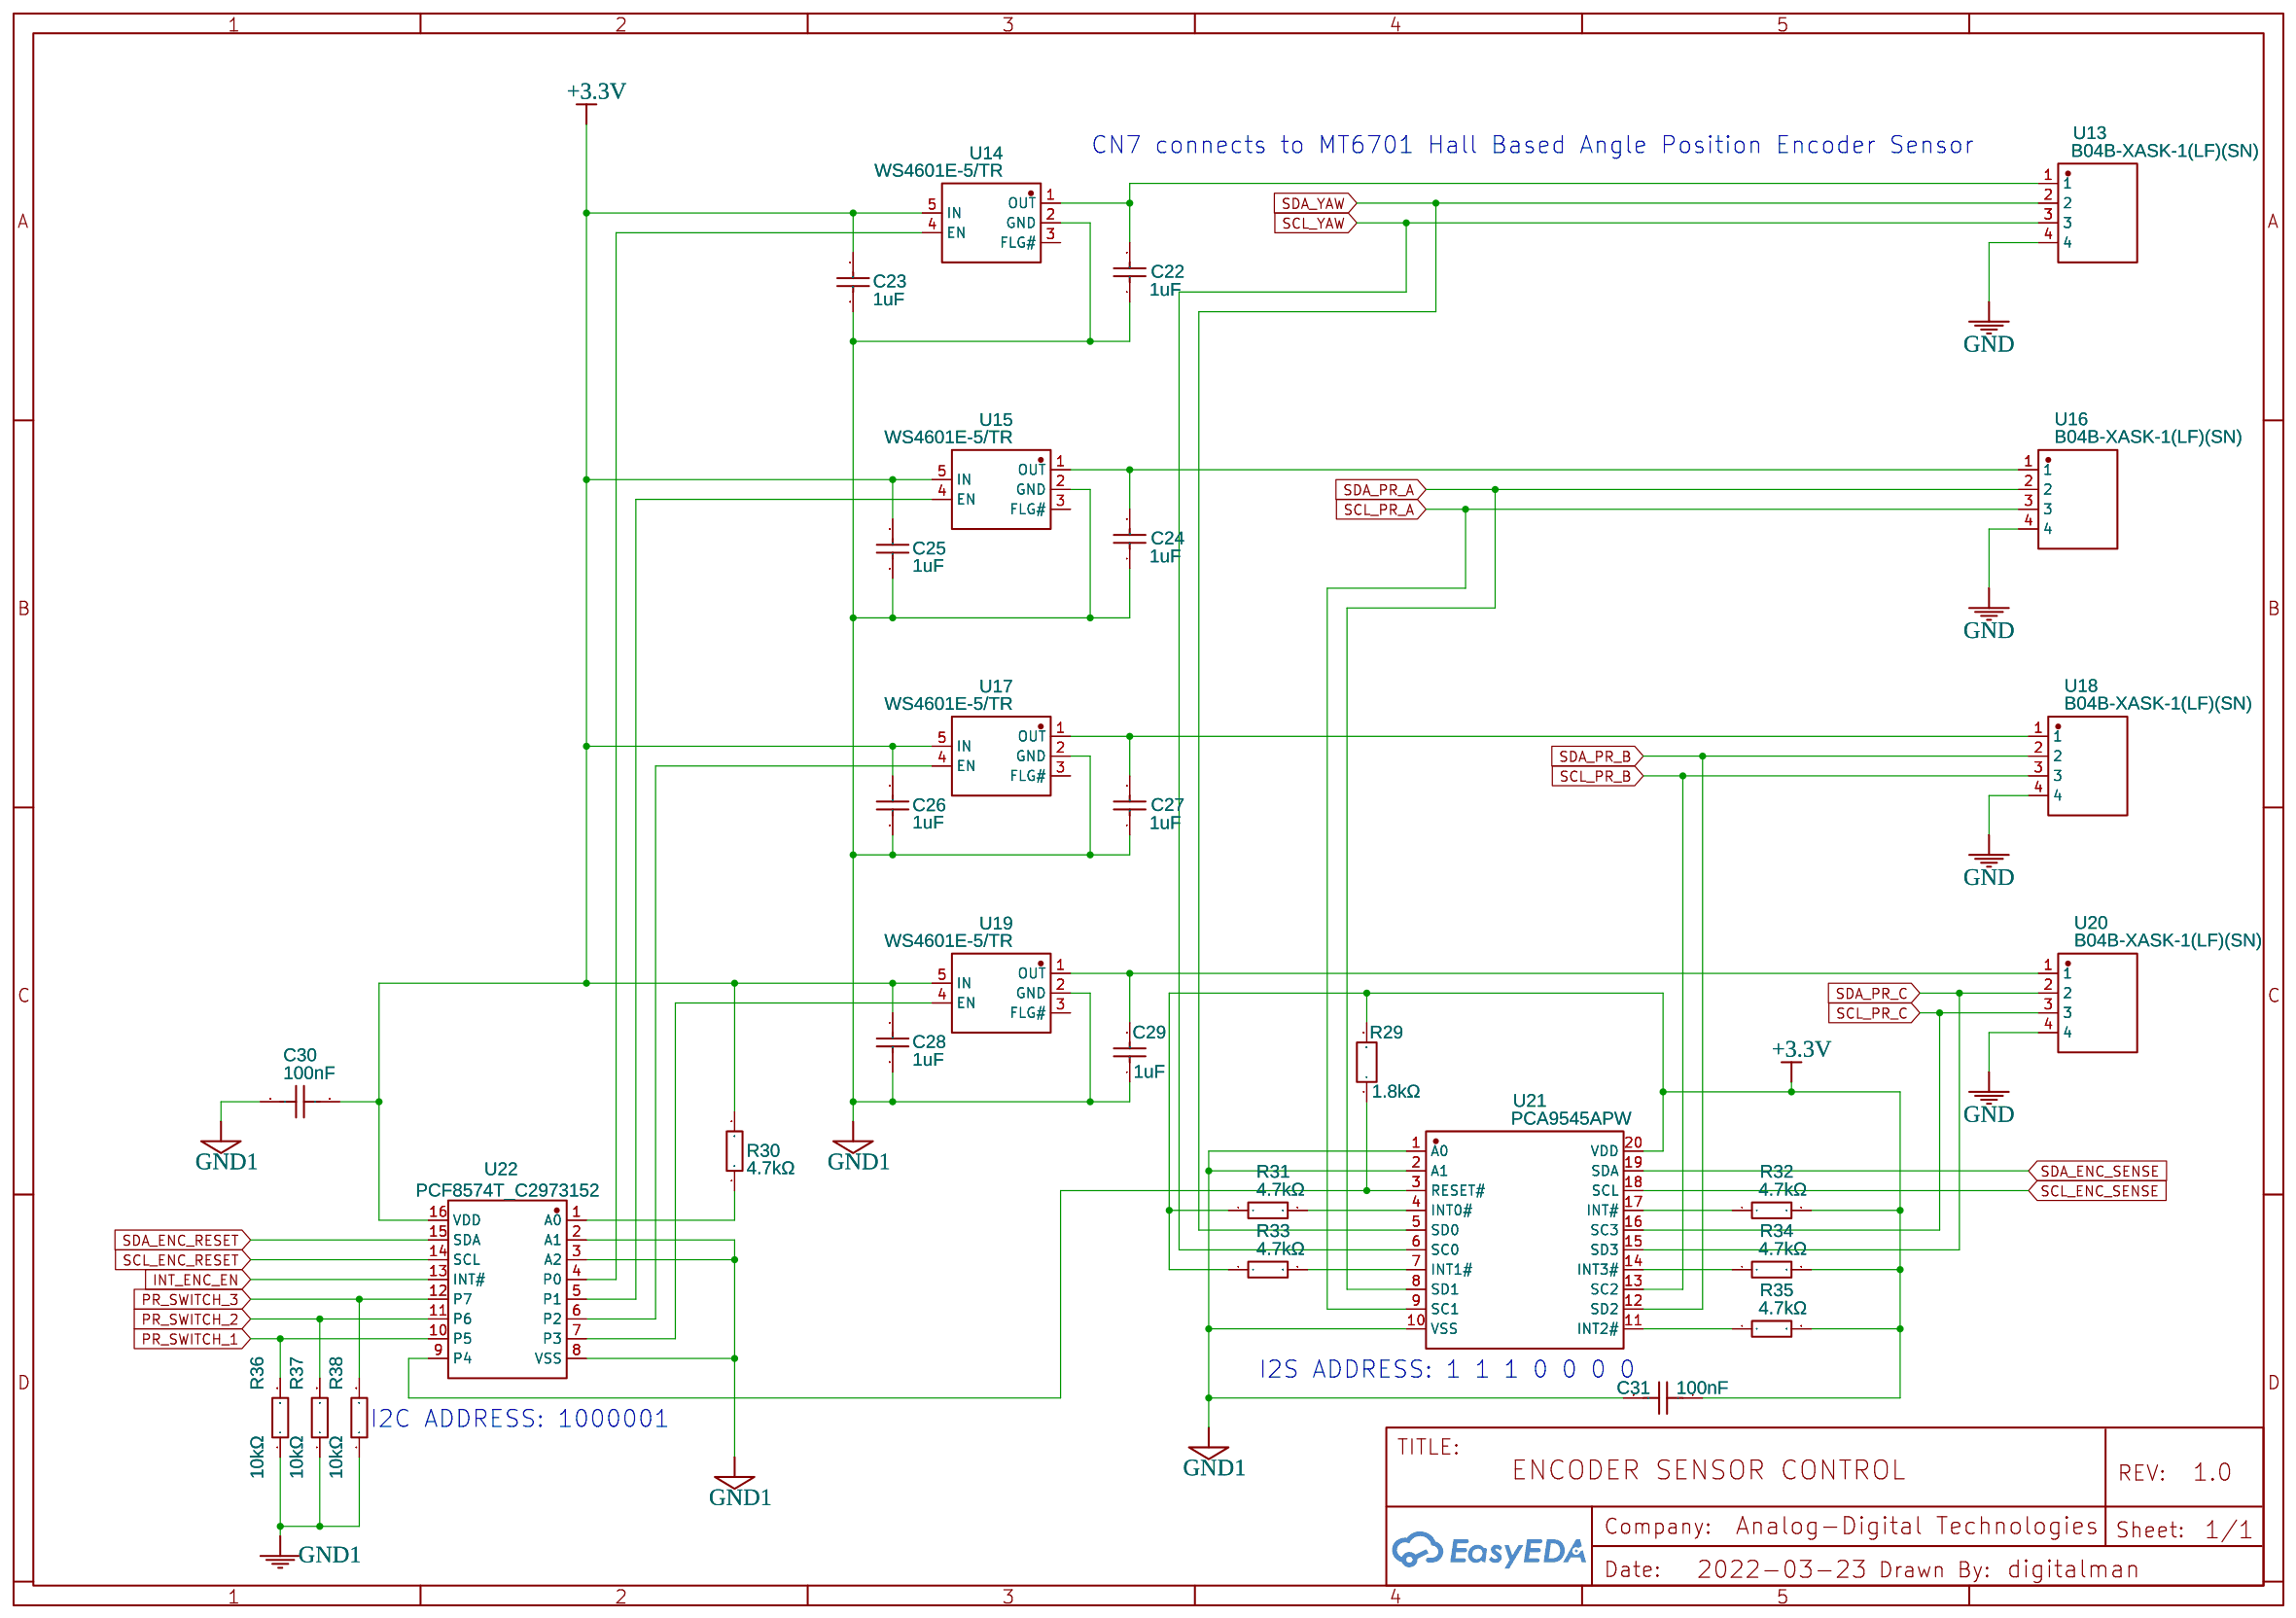
[diagram p9: ENC_SENSOR]

## Parts
sheet 6DOF
C8  100nF  [C0805]
C9  100nF  [C0805]
R22  NOT REQUIRED  [R0805]
R23  NOT REQUIRED  [R0805]
R24  10kΩ  [R0805]
U6  LSM6DS3TR  [LGA-14_L3.0-W2.5-P0.50-TL]
U7  SQ-SEN-200-MTR  [SW-SMD_SQ-SEN-200-MTR]
sheet A_PITCHROLL
C16  10uF  [CAP-SMD_BD4.0-L4.3-W4.3-FD]
C17  10uF  [CAP-SMD_BD4.0-L4.3-W4.3-FD]
CN8  Pitch-Roll Power A  [CONN-TH_8P-P4.20_X9357WV-2-04-N2SN]
P/R_1  3961R-4P  [CONN-TH_4P-P3.96_3961R-4P]
U10  MOTOR_DRIVER_150w  [MOTOR_DRIVE_150W_MODULE]
sheet B_PITCHROLLER
C18  10uF  [CAP-SMD_BD4.0-L4.3-W4.3-FD]
C19  10uF  [CAP-SMD_BD4.0-L4.3-W4.3-FD]
CN9  Pitch-Roll Power B  [CONN-TH_8P-P4.20_X9357WV-2-04-N2SN]
P/R_2  3961R-4P  [CONN-TH_4P-P3.96_3961R-4P]
U11  MOTOR_DRIVER_150w  [MOTOR_DRIVE_150W_MODULE]
sheet BUTTONS_LEDS
C5  100nF  [C0805]
CN3  PR_SWITCH_1  [CONN-TH_B2B-XH-AM-LF-SN]
CN4  PR_SWITCH_2  [CONN-TH_B2B-XH-AM-LF-SN]
CN5  PR_SWITCH_3  [CONN-TH_B2B-XH-AM-LF-SN]
LED1  MHK2396YGGBTD  [LED-TH_MHK2396YGGBTD]
POWER  K6-6156F-02  [SW-TH_K6-6156F-02]
R7  10kΩ  [R0805]
R8  10kΩ  [R0805]
R9  10kΩ  [R0805]
R10  10kΩ  [R0805]
R11  330  [R0805]
R12  330  [R0805]
R13  10kΩ  [R0805]
R14  330  [R0805]
SW2  GT-TC193A-H0675-L1  [SW-TH_GT-TC193A-H0675-L1]
U3  TPS3823-33DBVR  [SOT-23-5_L3.0-W1.7-P0.95-LS2.8-BR]
U4  MAX16054AZT+T  [TSOT-23-6_L2.9-W1.6-P0.95-LS2.8-TL]
sheet C_PITCHROLLER
C20  10uF  [CAP-SMD_BD4.0-L4.3-W4.3-FD]
C21  10uF  [CAP-SMD_BD4.0-L4.3-W4.3-FD]
CN10  Pitch-Roll Power B  [CONN-TH_8P-P4.20_X9357WV-2-04-N2SN]
P/R_3  3961R-4P  [CONN-TH_4P-P3.96_3961R-4P]
U12  MOTOR_DRIVER_150w  [MOTOR_DRIVE_150W_MODULE]
sheet ENC_SENSOR
C22  1uF  [C1206]
C23  1uF  [C1206]
C24  1uF  [C1206]
C25  1uF  [C1206]
C26  1uF  [C1206]
C27  1uF  [C1206]
C28  1uF  [C1206]
C29  1uF  [C1206]
C30  100nF  [C0805]
C31  100nF  [C0805]
R29  1.8kΩ  [R0805]
R30  4.7kΩ  [R0805]
R31  4.7kΩ  [R0805]
R32  4.7kΩ  [R0805]
R33  4.7kΩ  [R0805]
R34  4.7kΩ  [R0805]
R35  4.7kΩ  [R0805]
R36  10kΩ  [R0805]
R37  10kΩ  [R0805]
R38  10kΩ  [R0805]
U13  B04B-XASK-1(LF)(SN)  [CONN-TH_B04B-XASK-1-LF-SN]
U14  WS4601E-5/TR  [SOT-23-5_L2.9-W1.6-P0.95-LS2.8-BL]
U15  WS4601E-5/TR  [SOT-23-5_L2.9-W1.6-P0.95-LS2.8-BL]
U16  B04B-XASK-1(LF)(SN)  [CONN-TH_B04B-XASK-1-LF-SN]
U17  WS4601E-5/TR  [SOT-23-5_L2.9-W1.6-P0.95-LS2.8-BL]
U18  B04B-XASK-1(LF)(SN)  [CONN-TH_B04B-XASK-1-LF-SN]
U19  WS4601E-5/TR  [SOT-23-5_L2.9-W1.6-P0.95-LS2.8-BL]
U20  B04B-XASK-1(LF)(SN)  [CONN-TH_B04B-XASK-1-LF-SN]
U21  PCA9545APW  [TSSOP-20_L6.5-W4.4-P0.65-LS6.4-BL]
U22  PCF8574T_C2973152  [SO-16_L10.3-W7.5-P1.27-LS10.3-BL]
sheet MCU
C1  22uF  [C0805]
C2  22uF  [C0805]
C3  100nF  [C0805]
C4  1uF  [C1206]
C32  1000uF  [CAP-SMD_BD8.0-L8.3-W8.3-LS9.1-FD]
CN2  ANALOG_AUX  [CONN-TH_HX39601-6WAD]
J1  ATX24RH  [ATX24_RIGHT_ANGLE]
R1  4.7kΩ  [R0805]
R2  4.7kΩ  [R0805]
R3  10kΩ  [R0805]
R4  4.7kΩ  [R0805]
R5  4.7kΩ  [R0805]
R6  10kΩ  [R0805]
R39  10kΩ  [R0805]
SW1  DFP201612NF-2R2M  [IND-SMD_L2.0-W1.6]
SW4  DFP201612NF-2R2M  [IND-SMD_L2.0-W1.6]
TERMINAL  LCD_I2C  [CONN-TH_B5B-XH-AM-LF-SN]
U1  ESP32-WROOM-32E(4MB)  [WIFI-SMD_ESP32-WROOM-32E]
U2  PCF8574T_C2973152  [SO-16_L10.3-W7.5-P1.27-LS10.3-BL]
sheet SOUND BUZZER
BUZZER1  HMB1275-05B  [BUZ-TH_BD12.0-P7.60-D0.6-FD]
C10  1uF  [C1206]
C11  1uF  [C1206]
C12  1uF  [C1206]
C13  1uF  [C1206]
Q2  L2N7002KLT1G  [SOT-23-3]
R25  330  [R0805]
R26  10kΩ  [R0805]
R27  12kΩ  [R0805]
R28  12kΩ  [R0805]
SPEAKER  B2B-XH-AM (LF)(SN)  [CONN-TH_B2B-XH-AM-LF-SN]
U8  HT6873  [SOP-8_L4.9-W3.9-P1.27-LS6.0-BL]
sheet USB_SERIAL
C6  4.7uF  [C0805]
C7  100nF  [C0805]
CN6  USB-B-Female-Port  [USB-B_TH_BF90]
D1  BST23C032V  [SOT-23_L2.9-W1.3-P1.90-LS2.4-BR]
D2  BAT760-7  [SOD-323_L1.8-W1.3-LS2.5-RD]
D3  LESD5D5.0CT1G  [SOD-523_L1.2-W0.8-LS1.6-BI]
D4  BAT54C  [SOT-23-3_L2.9-W1.6-P1.90-LS2.8-BR]
Q1  UMH3N  [SC-70-6_L2.2-W1.3-P0.65-LS2.1-BR]
R15  0  [R0805]
R16  0  [R0805]
R17  2kΩ  [R0805]
R18  22.1K  [R0805]
R19  10kΩ  [R0805]
R20  47.5kΩ  [R0805]
R21  220  [R0805]
SW3  DSWB03LHGET  [SW-TH_DSWB03LHGET]
U5  CP2102-GMR  [QFN-28_L5.0-W5.0-P0.50-BL-EP]
sheet YAW_POWER
C14  10uF  [CAP-SMD_BD4.0-L4.3-W4.3-FD]
C15  10uF  [CAP-SMD_BD4.0-L4.3-W4.3-FD]
CN7  Yaw Power  [CONN-TH_8P-P4.20_X9357WV-2-04-N2SN]
U9  MOTOR_DRIVER_150w  [MOTOR_DRIVE_150W_MODULE]
YAW  3961R-4P  [CONN-TH_4P-P3.96_3961R-4P]

## Library data of the parts
C3 C5 C7-C9 C30 C31 = CC0805KRX7R8BB104: Supplier: LCSC; Supplier Part: C519981; Manufacturer: YAGEO; Contributor: LCSC; JLCPCB Part Class: Extended Part
R1 R2 R4 R5 R22 R23 R30-R35 = 0805W8J0472T5E: Supplier: LCSC; Manufacturer: UniOhm; Supplier Part: C26022; Resistance (Ohms): 4.7K; JLCPCB Part Class: Extended Part
R3 R6-R10 R13 R19 R24 R26 R36-R39 = TR0805D10KP0550: Supplier: LCSC; Supplier Part: C332266; Manufacturer: Ever Ohms Tech; Resistance (Ohms): 10K; Contributor: LCSC; JLCPCB Part Class: Extended Part
U6 = LSM6DS3TR: Supplier: LCSC; Supplier Part: C95230; Manufacturer: STMicroelectronics; Contributor: LCSC; JLCPCB Part Class: Extended Part
U7 = SQ-SEN-200-MTR: Supplier: LCSC; Supplier Part: C2687703; Manufacturer: SignalQuest; Contributor: LCSC; JLCPCB Part Class: Extended Part
C14-C21 = VT1E100M0405: Supplier: LCSC; Supplier Part: C213486; Manufacturer: ROQANG; Contributor: LCSC; JLCPCB Part Class: Extended Part
CN7-CN10 = X9357WV-2*04-N2SN: Supplier: LCSC; Supplier Part: C519240; Manufacturer: XKB Enterprise; Contributor: LCSC; JLCPCB Part Class: Extended Part
P/R_1-P/R_3 YAW = 3961R-4P: Supplier: LCSC; Manufacturer: Ckmtw; Contributor: LCSC; Supplier Part: C138427; JLCPCB Part Class: Extended Part
U9-U12 = MOTOR_DRIVER_150w: Contributor: digitalman
CN3-CN5 SPEAKER = B2B-XH-AM (LF)(SN): Supplier: LCSC; Supplier Part: C161869; Manufacturer: JST Sales America; Contributor: LCSC; JLCPCB Part Class: Extended Part
LED1 = MHK2396YGGBTD: Supplier: LCSC; Supplier Part: C409768; Manufacturer: MEIHUA; Contributor: LCSC; JLCPCB Part Class: Extended Part
POWER = K6-6156F-02: Supplier: LCSC; Supplier Part: C2848638; Manufacturer: 韩国韩荣; Contributor: LCSC
R11 R12 R14 R25 = AC0805FR-07330RL: Supplier: LCSC; Manufacturer: YAGEO; Contributor: LCSC; Supplier Part: C144564; JLCPCB Part Class: Extended Part; Resistance: 330Ω
SW2 = GT-TC193A-H0675-L1: Supplier: LCSC; Supplier Part: C2835017; Manufacturer: G-Switch(品赞); Contributor: LCSC
U3 = TPS3823-33DBVR: Supplier: LCSC; Manufacturer: TI; Supplier Part: C7719; JLCPCB Part Class: Extended Part
U4 = MAX16054AZT+T: Supplier: LCSC; Manufacturer: MAXIM; Contributor: LCSC; Supplier Part: C79401; JLCPCB Part Class: Extended Part
C4 C10-C13 C22-C29 = CC1206KKX7R8BB105: Supplier: LCSC; Manufacturer: YAGEO; Supplier Part: C107184; JLCPCB Part Class: Extended Part
R29 = RT0805BRE071K8L: Supplier: LCSC; Supplier Part: C513603; Manufacturer: YAGEO; Contributor: LCSC
U13 U16 U18 U20 = B04B-XASK-1(LF)(SN): Supplier: LCSC; Supplier Part: C264994; Manufacturer: JST Sales America; Contributor: LCSC; JLCPCB Part Class: Extended Part
U14 U15 U17 U19 = WS4601E-5/TR: Supplier: LCSC; Supplier Part: C213171; Manufacturer: WILLSEMI(Will Semicon); Contributor: LCSC; JLCPCB Part Class: Extended Part
U21 = PCA9545APW: Supplier: LCSC; Manufacturer: NXP; Contributor: LCSC; Supplier Part: C129515; JLCPCB Part Class: Extended Part
U2 U22 = PCF8574T_C2973152: Supplier: LCSC; Supplier Part: C7605; Manufacturer: NXP Semicon; Manufacturer Part: PCF8574T/3,518; link: https://atta.szlcsc.com//upload/public/pdf/source/20190611/C398075_1925312D8618E19C6137781D5B71A3CA.pdf; Contributor: LCSC; JLCPCB Part Class: Extended Part
C1 C2 = CL21A226KQQNNNE: Supplier: LCSC; Manufacturer: SAMSUNG; Supplier Part: C87997; JLCPCB Part Class: Extended Part
C32 = RT1A102M0810: Supplier: LCSC; Supplier Part: C280406; Manufacturer: ROQANG; Contributor: LCSC; JLCPCB Part Class: Extended Part
CN2 = HX39601-6WAD: Supplier: LCSC; Supplier Part: C703276; Manufacturer: HX(红星); Contributor: LCSC; JLCPCB Part Class: Extended Part
J1 = ATX24RH: ATX24 Pin Power Supply Connector This is a good connector for connecting a computer power supply to a PCB. Its massive, but provides many amps of power at 5V and 12V. SKU: PRT-09498; Contributor: SparkFun; Manufacturer Part: M4202V-2x12P; Supplier: LCSC; Supplier Part: C492535; Manufacturer: XFCN(兴飞)
SW1 SW4 = DFP201612NF-2R2M: Supplier: LCSC; Supplier Part: C2880050; Manufacturer: 台庆; Inductance: 2.2uH; Contributor: LCSC
TERMINAL = B5B-XH-A-M(LF)(SN): Supplier: LCSC; Supplier Part: C495550; Manufacturer: JST Sales America; Contributor: LCSC; JLCPCB Part Class: Extended Part
U1 = ESP32-WROOM-32E(4MB): Supplier: LCSC; Supplier Part: C701341; Manufacturer: Espressif Systems; Contributor: LCSC; JLCPCB Part Class: Extended Part
BUZZER1 = HMB1275-05B: Supplier: LCSC; Manufacturer: HNDZ; Supplier Part: C96491; JLCPCB Part Class: Extended Part; Frequency: 2300Hz
Q2 = -: Supplier: LCSC; Manufacturer: LRC; Manufacturer Part: L2N7002SLT1G; Supplier Part: C250818
R27 R28 = HP05W3J0123T5E: Supplier: LCSC; Supplier Part: C414966; Manufacturer: UNI-ROYAL(Uniroyal Elec); Resistance (Ohms): 12K; Contributor: LCSC; JLCPCB Part Class: Extended Part
U8 = HT6873: Supplier: LCSC; Manufacturer: HEROIC; Supplier Part: C94920; JLCPCB Part Class: Extended Part
C6 = CL21A475KQFNNNE: Supplier: LCSC; Supplier Part: C140692; Manufacturer: Samsung Electro-Mechanics; Contributor: LCSC; JLCPCB Part Class: Extended Part
CN6 = USB-B-Female-TH_C46393: Supplier: LCSC; Manufacturer Part: 921-112A1010D10200; Supplier Part: C46393; JLCPCB Part Class: Extended Part; Manufacturer: Jing Extension of the Electronic Co.
D1 = BST23C032V: Supplier: LCSC; Supplier Part: C151968; Manufacturer: Bourne Semicon (Shenzhen); Contributor: LCSC; JLCPCB Part Class: Extended Part
D2 = BAT760-7: Supplier: LCSC; Manufacturer: DIODES; Contributor: LCSC; Supplier Part: C124187; JLCPCB Part Class: Extended Part
D3 = LESD5D5.0CT1G: Supplier: LCSC; Supplier Part: C383211; Manufacturer: Leshan Radio; Contributor: LCSC; JLCPCB Part Class: Extended Part
D4 = BAT54C: Supplier: LCSC; Manufacturer: CJ; Supplier Part: C2135; JLCPCB Part Class: Extended Part
Q1 = UMH3N: Supplier: LCSC; Manufacturer: CJ; Supplier Part: C62892; JLCPCB Part Class: Extended Part
R15 R16 = AC0805FR-070RL: Supplier: LCSC; Supplier Part: C174076; Manufacturer: YAGEO; Contributor: LCSC; JLCPCB Part Class: Extended Part; Resistance: 0Ω
R17 = PTFR0805B2K00P9: Supplier: LCSC; Supplier Part: C479096; Manufacturer: Resistor.Today; Resistance (Ohms): 2K; Contributor: LCSC; JLCPCB Part Class: Extended Part
R18 = CR0805-FX-2212ELF: Supplier: LCSC; Supplier Part: C204311; Manufacturer: BOURNS; Contributor: LCSC; JLCPCB Part Class: Extended Part; Resistance: 22.1kΩ
R20 = TC0525B4752T5E: Supplier: LCSC; Supplier Part: C79481; Manufacturer: Uniroyal Elec; Resistance (Ohms): 47.5K; Contributor: LCSC; JLCPCB Part Class: Extended Part
R21 = RC0805JR-7W220RL: Supplier: LCSC; Manufacturer: YAGEO; Contributor: LCSC; Supplier Part: C163392; JLCPCB Part Class: Extended Part; Resistance: 220Ω
SW3 = DSWB03LHGET: Supplier: LCSC; Supplier Part: C99420; Manufacturer: Dongguan Guangzhu Industrial; Contributor: LCSC; JLCPCB Part Class: Extended Part
U5 = CP2102-GMR: Supplier: LCSC; Manufacturer: SILICON LABS; Supplier Part: C6568; JLCPCB Part Class: Basic Part

## Nets
3.3V: C2.2 C32.1 R3.2 SW4.2 U1.2(3V3)
5V_Standby: J1.9(5V_STDBY) U4.6(VCC)
+3.3V: C1.2 C3.1 C5.2 C6.2 C7.2 C8.2 C9.2 C23.1 C25.1 C26.1 C28.1 C30.1 C31.1 CN2.6 R1.2 R2.2 R4.1 R5.1 R7.2 R8.2 R9.2 R10.2 R11.2 R12.2 R17.1 R22.2 R23.2 R24.2 R29.2 R30.2 R31.1 R32.2 R33.1 R34.2 R35.2 SW1.2 TERMINAL.4 U2.16(VDD) U3.5(VDD) U5.6(VDD) U5.7(REGIN) U6.5(VDDIO) U6.8(VDD) U7.2 U14.5(IN) U15.5(IN) U17.5(IN) U19.5(IN) U21.20(VDD) U22.16(VDD)
+5V: C10.1 CN2.4 J1.4(5V) J1.6(5V) J1.21(5V) J1.22(5V) J1.23(5V) TERMINAL.5 U8.6(VDD)
+12V_PR_A: C16.1 C17.1 CN8.1 CN8.2 CN8.3 P/R_1.4 U10.1(+12V_YAW) U10.2(+12V_YAW) U10.4(+12V_YAW)
+12V_PR_B: C18.1 C19.1 CN9.1 CN9.2 CN9.3 P/R_2.4 U11.1(+12V_YAW) U11.2(+12V_YAW) U11.4(+12V_YAW)
+12V_PR_C: C20.1 C21.1 CN10.1 CN10.2 CN10.3 P/R_3.4 U12.1(+12V_YAW) U12.2(+12V_YAW) U12.4(+12V_YAW)
+12V_VCC: BUZZER1.1(+) J1.10(12V) J1.11(12V) U9.14(+12V_VCC) U10.14(+12V_VCC) U11.14(+12V_VCC) U12.14(+12V_VCC)
+12V_YAW: C14.1 C15.1 CN7.1 CN7.2 CN7.3 U9.1(+12V_YAW) U9.2(+12V_YAW) U9.4(+12V_YAW) YAW.4
GND: C1.1 C2.1 C3.2 C4.2 C5.1 C6.1 C7.1 C8.1 C9.1 C10.2 C11.2 C12.2 C14.2 C15.2 C16.2 C17.2 C18.2 C19.2 C20.2 C21.2 C22.1 C23.2 C24.1 C25.2 C26.2 C27.1 C28.2 C29.1 C30.2 C31.2 C32.2 CN2.2 CN2.5 CN3.2 CN4.2 CN5.2 CN6.4(GND) CN6.5(EH) CN7.4 CN7.5 CN7.6 CN7.7 CN7.8 CN8.4 CN8.5 CN8.6 CN8.7 CN8.8 CN9.4 CN9.5 CN9.6 CN9.7 CN9.8 CN10.4 CN10.5 CN10.6 CN10.7 CN10.8 D1.3 D3.1 J1.3(GND) J1.5(GND) J1.7(GND) J1.15(GND) J1.17(GND) J1.18(GND) J1.19(GND) J1.24(GND) P/R_1.3 P/R_2.3 P/R_3.3 POWER.1 POWER.2 POWER.5 POWER.6 Q2.2(S) R13.1 R19.1 R20.1 R26.1 R36.1 R37.1 R38.1 R39.1 SW2.2(b) SW2.3(d) SW2.5 SW2.6 TERMINAL.3 U1.1(GND) U1.15(GND) U1.38(GND) U1.39(GND) U2.1(A0) U2.2(A1) U2.3(A2) U2.8(VSS) U3.2(GND) U4.2(GND) U5.3(GND) U6.1(SDO/SA0) U6.6(GND) U6.7(GND) U8.7(GND) U9.3(GND) U9.5(GND) U9.6(GND) U9.16(GND) U9.18(GND) U10.3(GND) U10.5(GND) U10.6(GND) U10.16(GND) U10.18(GND) U11.3(GND) U11.5(GND) U11.6(GND) U11.16(GND) U11.18(GND) U12.3(GND) U12.5(GND) U12.6(GND) U12.16(GND) U12.18(GND) U13.4 U14.2(GND) U15.2(GND) U16.4 U17.2(GND) U18.4 U19.2(GND) U20.4 U21.1(A0) U21.2(A1) U21.10(VSS) U22.2(A1) U22.3(A2) U22.8(VSS) YAW.3
VBUS: CN6.1(VCC) D2.2 D3.2
#LED_A: U2.6(P2)
A_OUT-A_PR: P/R_1.1 U10.7(OUT-A_YAW) U10.8(OUT-A_YAW) U10.10(OUT-A_YAW)
A_OUT-B_PR: P/R_1.2 U10.9(OUT-B_YAW) U10.11(OUT-B_YAW) U10.12(OUT-B_YAW)
A_PR_PWM_A: U1.12(IO27) U10.13(PWM-A_YAW)
A_PR_PWM_B: U1.23(IO15) U10.15(PWM-B_YAW)
ADC0: C4.1 R6.2 U1.4(SENSOR_VP)
AUDIO_MODE: U2.10(P5) U8.1(CTRL)
AUX: CN2.3 U1.5(SENSOR_VN)
B_OUT-A_PR: P/R_2.1 U11.7(OUT-A_YAW) U11.8(OUT-A_YAW) U11.10(OUT-A_YAW)
B_OUT-B_PR: P/R_2.2 U11.9(OUT-B_YAW) U11.11(OUT-B_YAW) U11.12(OUT-B_YAW)
B_PR_PWM_A: U1.33(IO21) U11.13(PWM-A_YAW)
B_PR_PWM_B: U1.9(IO33) U11.15(PWM-B_YAW)
BUZZER: R25.2 U1.10(IO25)
C_OUT-A_PR: P/R_3.1 U12.7(OUT-A_YAW) U12.8(OUT-A_YAW) U12.10(OUT-A_YAW)
C_OUT-B_PR: P/R_3.2 U12.9(OUT-B_YAW) U12.11(OUT-B_YAW) U12.12(OUT-B_YAW)
C_PR_PWM_A: U1.8(IO32) U12.13(PWM-A_YAW)
C_PR_PWM_B: U1.28(IO17) U12.15(PWM-B_YAW)
DAC2_AUDIO: C13.2 U1.11(IO26)
DTR: Q1.2(B) Q1.4(E) U5.28(DTR)
Esp_En: Q1.6(C) R3.1 SW3.3 U1.3(EN) U3.1(RESET#)
EXT_5V: D2.1 R18.1
GPIO0: D4.1(A1) SW2.4(c) SW3.5 U1.25(IO0)
GPIO2: SW3.4 U1.24(IO2)
INT_ENC_EN: U1.29(IO5) U22.13(INT#)
INT_IO: U1.26(IO4) U2.13(INT#)
LED_A: LED1.2 U2.4(P0)
LED_B: LED1.4 U2.5(P1)
MODE BTN: U1.7(IO35)
MOTOR_ENABLE: R39.2 U1.27(IO16) U9.17(MOTOR_ENABLE) U10.17(MOTOR_ENABLE) U11.17(MOTOR_ENABLE) U12.17(MOTOR_ENABLE)
OUT-A_YAW: U9.7(OUT-A_YAW) U9.8(OUT-A_YAW) U9.10(OUT-A_YAW) YAW.1
OUT-B_YAW: U9.9(OUT-B_YAW) U9.11(OUT-B_YAW) U9.12(OUT-B_YAW) YAW.2
PAIR BTN: R7.1 SW2.1(a) U2.7(P3)
Power_Down: R13.2 U2.11(P6) U4.3(CLEAR)
Power_OK: J1.8(PWR_OK) POWER.L1
PR_SWITCH_1: CN3.1 R8.1 R36.2 U22.10(P5)
PR_SWITCH_2: CN4.1 R9.1 R37.2 U22.11(P6)
PR_SWITCH_3: CN5.1 R10.1 R38.2 U22.12(P7)
PS_ON: J1.16(PS_ON) R14.1 U4.4(#OUT)
PWM-A_YAW: U1.13(IO14) U9.13(PWM-A_YAW)
PWM-B_YAW: U1.14(IO12) U9.15(PWM-B_YAW)
RTS: Q1.1(E) Q1.5(B) U5.24(RTS)
RXD: R15.2 U5.25(RXD)
SCL_6DOF: R5.2 R23.1 TERMINAL.2 U1.30(IO18) U6.13(SCL)
SCL_ENC_RESET: R2.1 U1.36(IO22) U2.14(SCL) U21.18(SCL) U22.14(SCL)
SCL_PR_A: U16.3 U21.9(SC1)
SCL_PR_B: U18.3 U21.13(SC2)
SCL_PR_C: U20.3 U21.16(SC3)
SCL_YAW: U13.3 U21.6(SC0)
SDA_6DOF: R4.2 R22.1 TERMINAL.1 U1.31(IO19) U6.14(SDA)
SDA_ENC_RESET: R1.1 U1.37(IO23) U2.15(SDA) U21.19(SDA) U22.15(SDA)
SDA_PR_A: U16.2 U21.8(SD1)
SDA_PR_B: U18.2 U21.12(SD2)
SDA_PR_C: U20.2 U21.15(SD3)
SDA_YAW: U13.2 U21.5(SD0)
TXD: R16.2 U5.26(TXD)
U0RXD: R16.1 U1.34(RXD0)
U0TXD: R15.1 U1.35(TXD0)
USB_autoreset: R17.2 SW3.6 U5.9(RST#)
VIBRATION: U2.9(P4) U7.1
Net-(BUZZER1-2): BUZZER1.2 Q2.3(D)
Net-(C11-1): C11.1 U8.2(BYPASS)
Net-(C12-1): C12.1 R27.1
Net-(C13-1): C13.1 R28.1
Net-(C22-2): C22.2 U13.1 U14.1(OUT)
Net-(C24-2): C24.2 U15.1(OUT) U16.1
Net-(C27-2): C27.2 U17.1(OUT) U18.1
Net-(C29-2): C29.2 U19.1(OUT) U20.1
Net-(CN2-1): CN2.1 R6.1
Net-(CN6-2): CN6.2(D-) D1.1 U5.5(D-)
Net-(CN6-3): CN6.3(D+) D1.2 U5.4(D+)
Net-(D4-2): D4.2(A2) SW3.1
Net-(D4-3): D4.3(K) R21.2
Net-(J1-1): J1.1(3.3V) J1.2(3.3V) SW1.1
Net-(J1-12): J1.12(3.3V) J1.13(3.3V) SW4.1
Net-(LED1-1): LED1.1 R12.1
Net-(LED1-3): LED1.3 R11.1
Net-(POWER-3): POWER.3 POWER.4 U3.3(MR#) U4.1(IN)
Net-(POWER-L2): POWER.L2 R14.2
Net-(Q1-3): Q1.3(C) R21.1 SW3.2
Net-(Q2-1): Q2.1(G) R25.1 R26.2
Net-(R18-2): R18.2 R20.2 U5.8(VBUS)
Net-(R19-2): R19.2 U5.11(SUSPEND#)
Net-(R24-1): R24.1 U6.12(CS)
Net-(R27-2): R27.2 U8.3(IN-)
Net-(R28-2): R28.2 U8.4(IN+)
Net-(R29-1): R29.1 U21.3(RESET#) U22.9(P4)
Net-(R30-1): R30.1 U22.1(A0)
Net-(R31-2): R31.2 U21.4(INT0#)
Net-(R32-1): R32.1 U21.17(INT#)
Net-(R33-2): R33.2 U21.7(INT1#)
Net-(R34-1): R34.1 U21.14(INT3#)
Net-(R35-1): R35.1 U21.11(INT2#)
Net-(SPEAKER-1): SPEAKER.1 U8.8(OUT-)
Net-(SPEAKER-2): SPEAKER.2 U8.5(OUT+)
Net-(U14-4): U14.4(EN) U22.4(P0)
Net-(U15-4): U15.4(EN) U22.5(P1)
Net-(U17-4): U17.4(EN) U22.6(P2)
Net-(U19-4): U19.4(EN) U22.7(P3)

Not connected (* = marked no-connect by the designer): J1 14(-12V) 20(NC); U1 6(IO34) 16(IO13) 17(NC) 18(NC) 19(NC) 20(NC) 21(NC) 22(NC) 32(NC); U2 12(P7); U3 4(WDI); U4 5(OUT); U5 1(DCD) 2(RI) 10(NC) 12(SUSPEND) 13(NC) 14(NC) 15(NC) 16(NC) 17(NC) 18(NC) 19(NC) 20(NC) 21(NC) 22(NC) 23(CTS) 27(DSR) 29(EP); U6 2(SDX) 3(SCX) 4(INT1) 9(INT2) 10(NC) 11(NC); U14 3(FLG#); U15 3(FLG#); U17 3(FLG#); U19 3(FLG#)

## Notes on the sheets
sheet 1
- I2C ADDRESS: 1000001
- I2S ADDRESS: 1 1 1 0 0 0 0
- I2C ADDRESS: 1000000
- I2C ADDRESS: 1000000
sheet 2
- ALTERNATIVE MAX811TEUS+T
- MCU Reset
- Power Switch: Push Button Latching Circuit
sheet 4
- 6 DOF IMU on Base
sheet 5
- BUZZER
sheet 8
- Analog-Digital Technologies
sheet 10
- CN7 connects to MT6701 Hall Based Angle Position Encoder Sensor
- I2S ADDRESS: 1 1 1 0 0 0 0
- I2C ADDRESS: 1000001
